# EAGLE board old_eagle_line_sensor (EAGLE 7.7.0), part 1 of 2
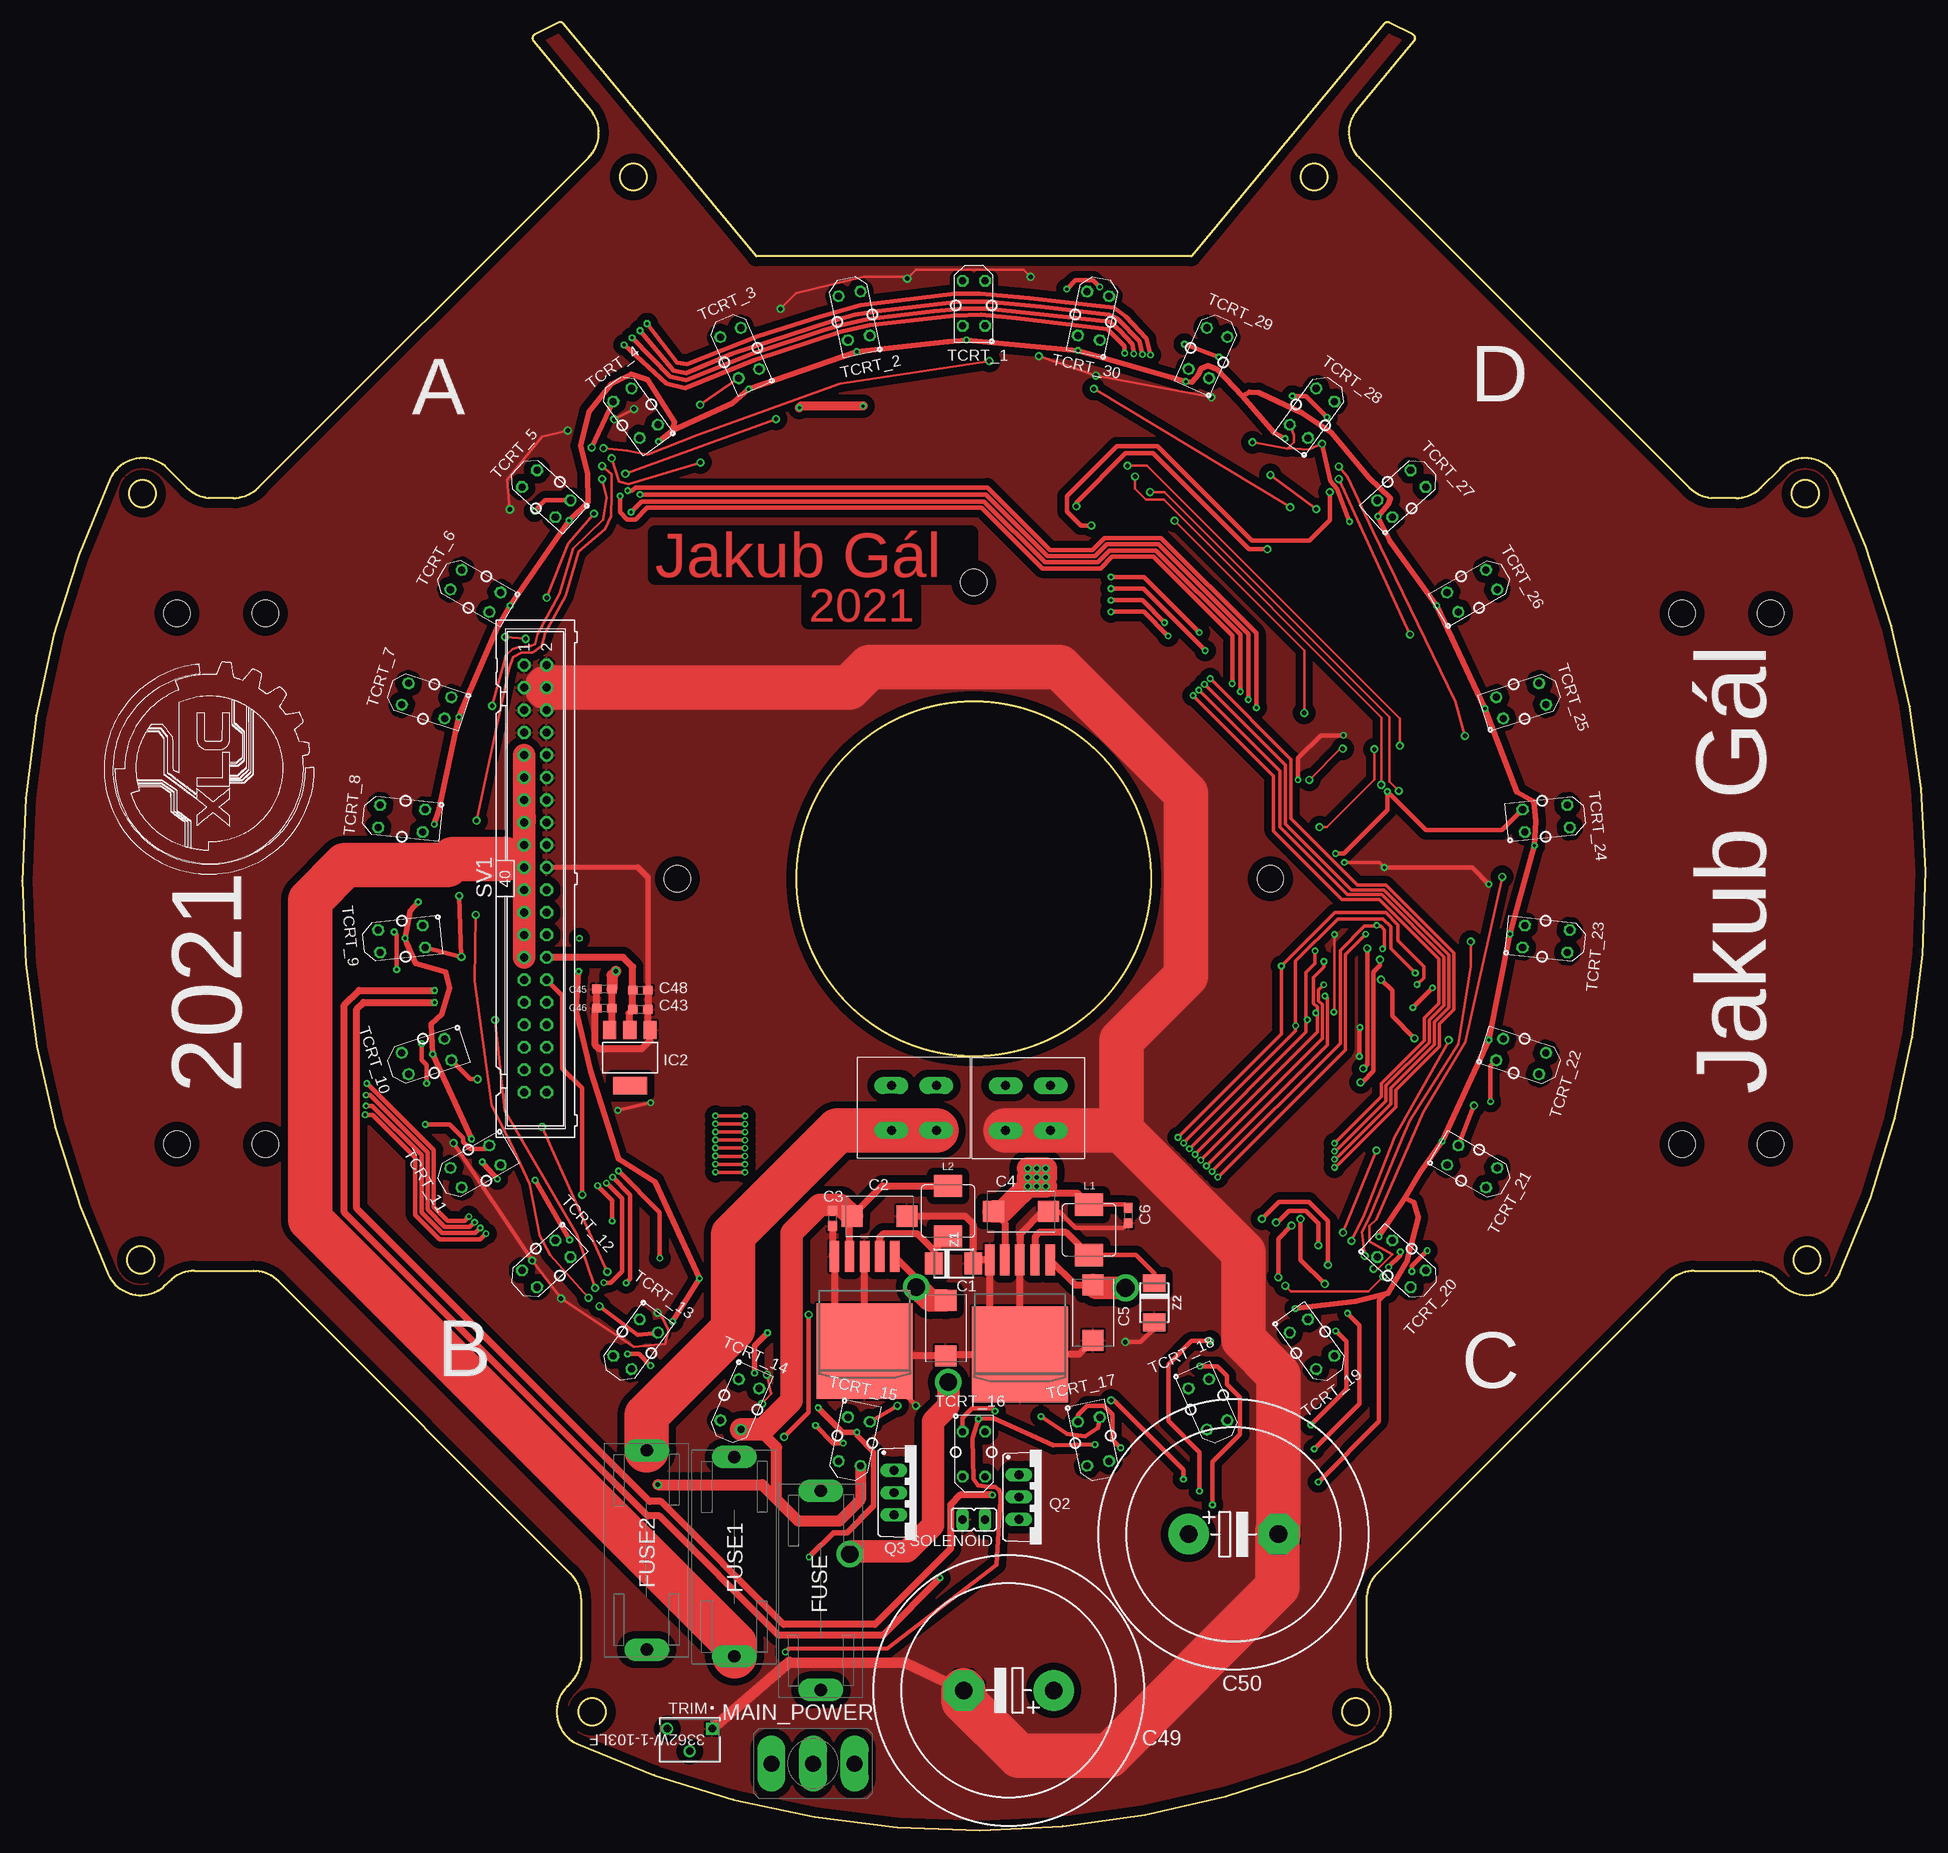
[diagram p2: board, top side]
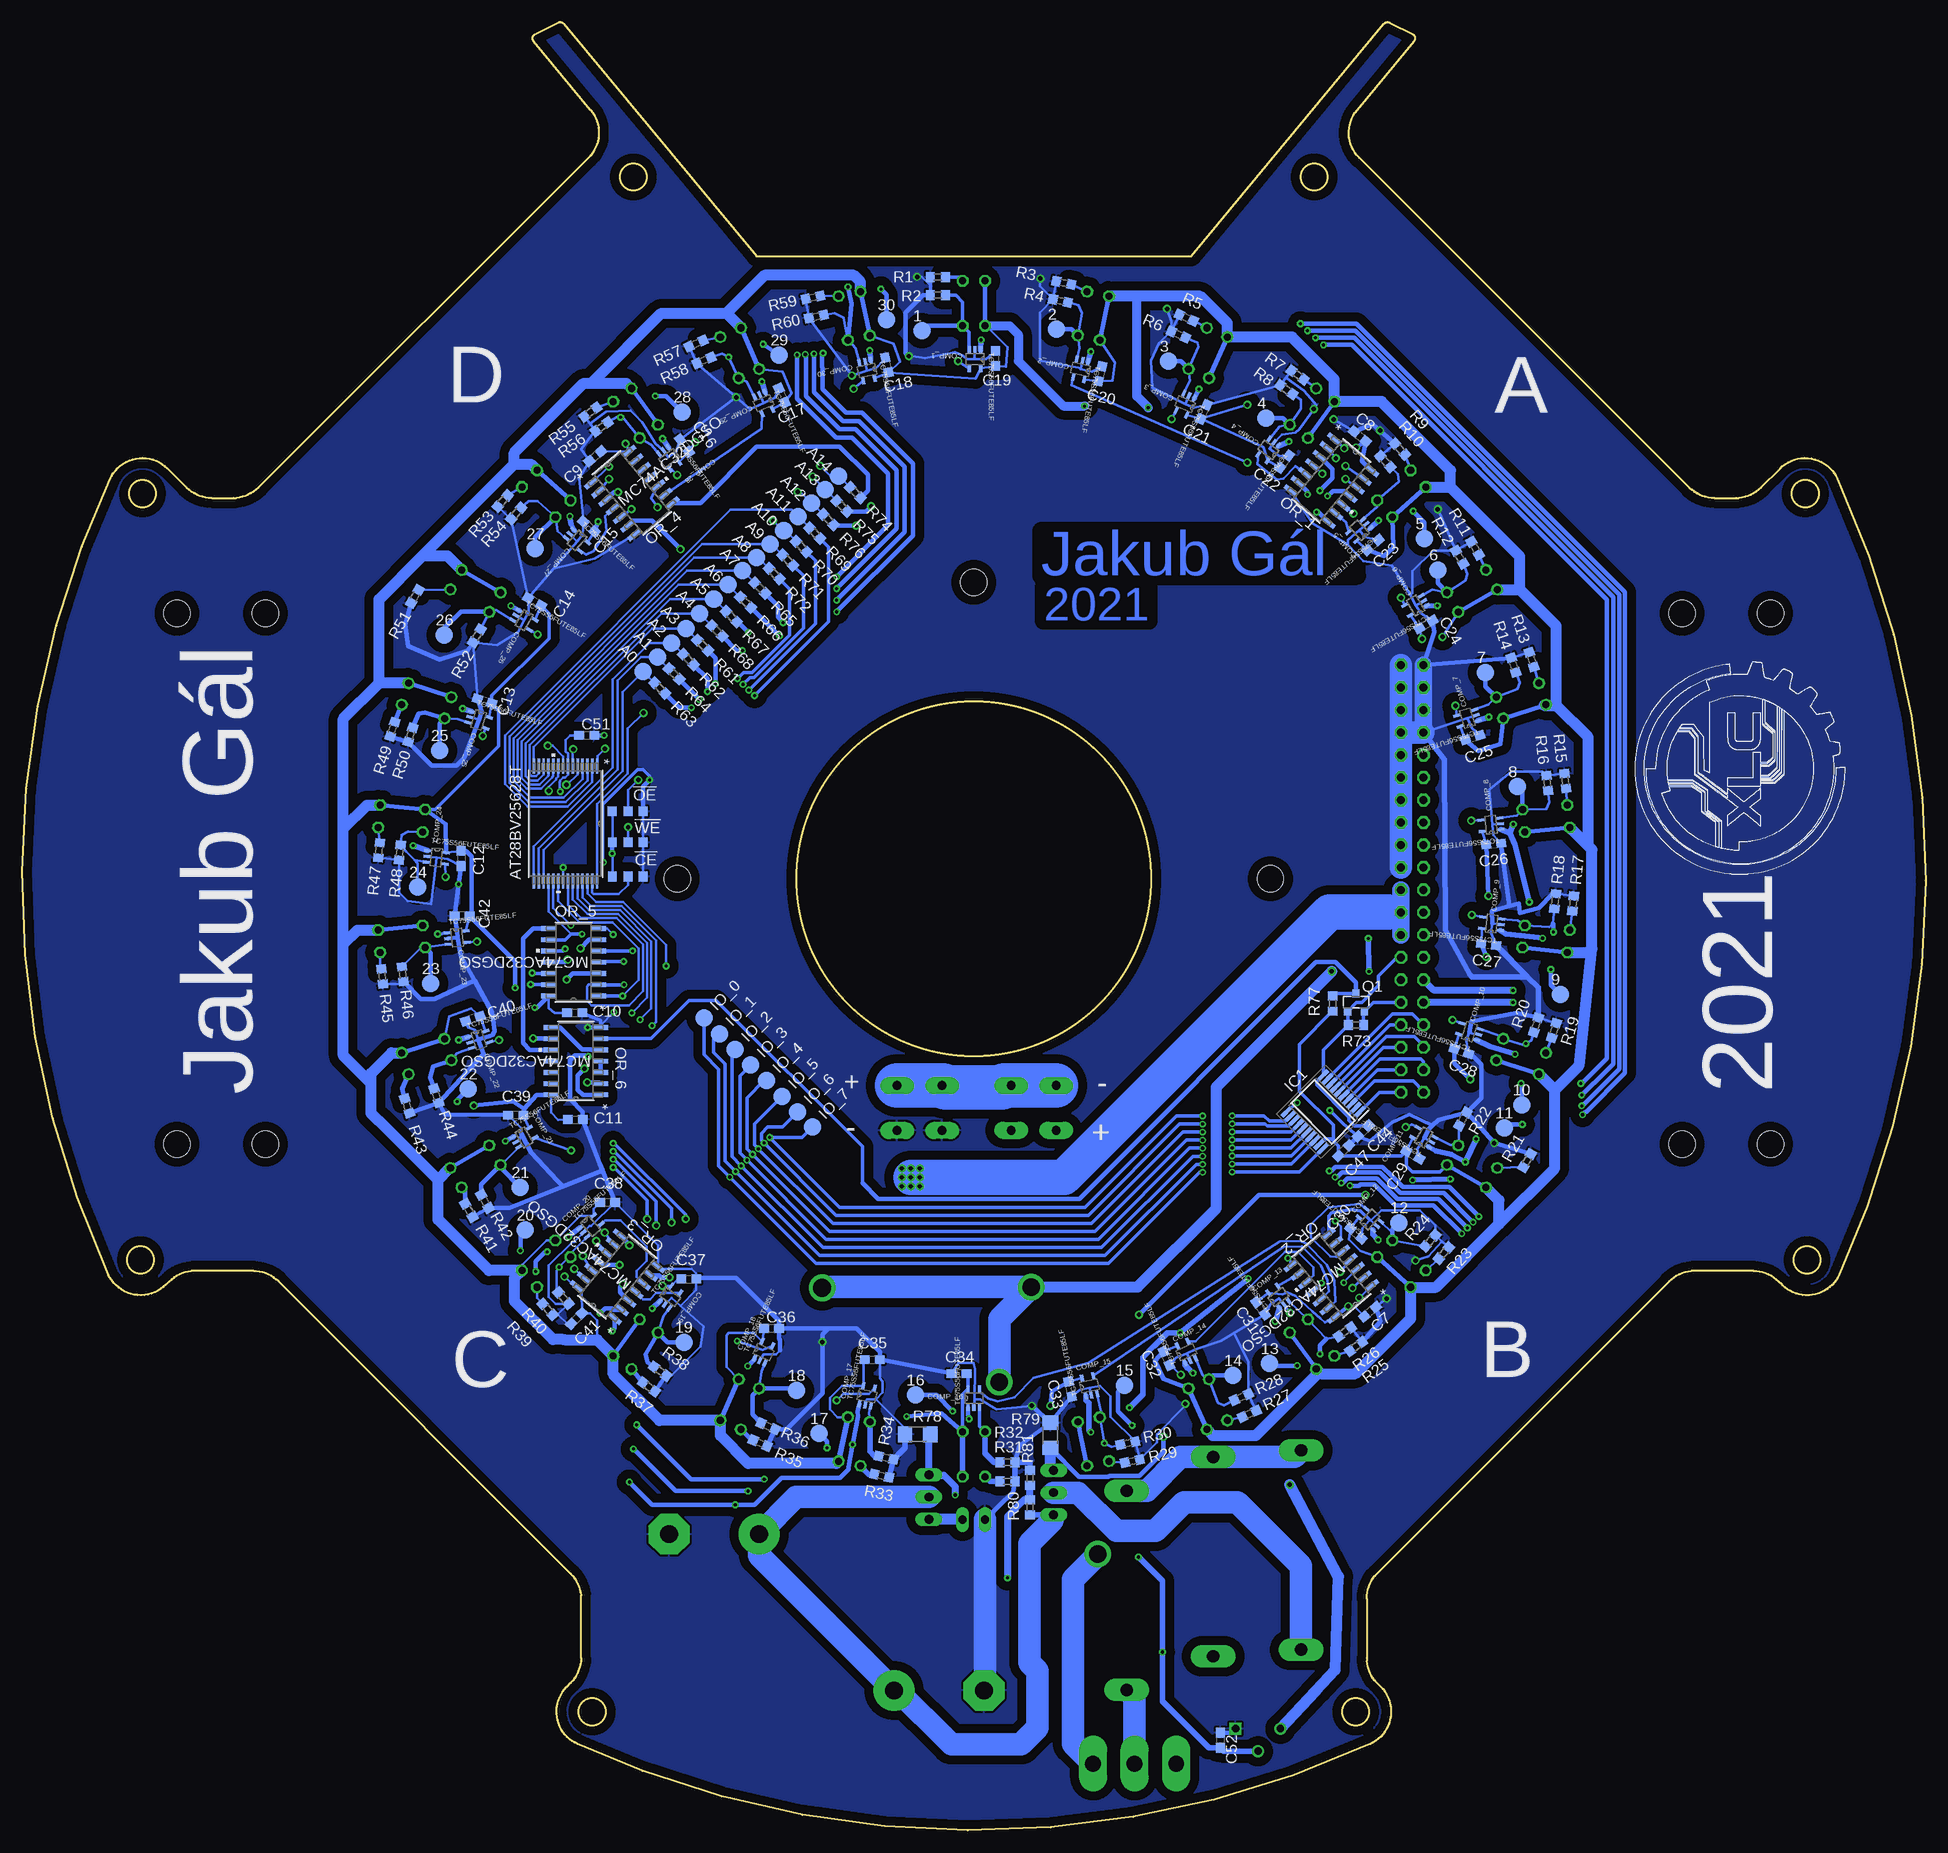
[diagram p3: board, bottom side, seen from below]

Size 215 x 204.25 mm. Coordinates in mm from the lower left corner, seen from the top.
Outline: 18.59,151.67 18.59,151.67 16.42,153.84 16.16,154.08 arc95 10.32,153.31 10.13,153.02 9.97,152.71 9.96,152.7 6.39,144.02 arc40 6.57,70.49 9.74,62.78 9.9,62.47 10.08,62.18 10.29,61.9 10.53,61.64 arc90 16.19,61.6 16.2,61.62 16.62,62.03 16.87,62.27 arc-40 19.44,63.2 26.13,63.2 26.48,63.19 arc-40 28.96,62.03 28.96,62.03 61.96,29 62.19,28.74 arc-40 63.13,26.17 63.13,19.49 63.11,19.14 arc-40 61.96,16.66 61.54,16.24 61.3,15.99 arc80 61.3,10.84 61.54,10.59 61.79,10.35 62.07,10.14 62.37,9.95 62.68,9.79 62.7,9.78 arc45 144.92,6.72 152.3,9.78 152.61,9.94 152.9,10.12 arc10 153.44,10.57 153.68,10.82 153.89,11.1 arc80 153.48,16.22 153.46,16.24 153.04,16.66 152.81,16.91 arc-40 151.87,19.49 151.87,26.17 151.89,26.52 arc-40 153.04,29 186.04,62.03 186.3,62.26 arc-40 188.87,63.2 195.55,63.2 195.9,63.19 arc-40 198.38,62.03 198.79,61.62 199.05,61.38 arc95 204.9,62.16 205.09,62.45 205.25,62.76 205.26,62.78 arc45 208.24,145.01 205.04,152.7 204.88,153.01 204.69,153.3 arc100 198.59,153.85 198.58,153.84 196.41,151.67 196.15,151.44 arc-40 193.58,150.5 191.16,150.5 190.81,150.51 arc-40 188.33,151.67 151.03,188.93 150.79,189.19 arc-80 150.77,194.31 157.23,202.12 157.26,202.16 arc55 157.31,202.62 157.3,202.66 157.28,202.69 157.25,202.73 157.23,202.76 157.2,202.8 157.16,202.83 arc0 157.09,202.88 157.08,202.88 154.45,204.2 arc0 154.32,204.25 154.28,204.25 154.24,204.25 154.19,204.25 154.15,204.25 154.11,204.24 arc35 153.85,204.08 153.84,204.07 132.05,177.8 82.94,177.8 61.15,204.07 61.13,204.11 arc70 60.56,204.21 60.55,204.2 57.92,202.88 57.89,202.86 arc0 57.82,202.81 57.79,202.78 arc80 57.76,202.14 57.77,202.12 64.23,194.31 64.44,194.03 arc-80 63.97,188.93 26.67,151.67 26.41,151.43 arc-40 23.84,150.5 21.42,150.5 21.07,150.51 arc-40 18.59,151.67
Outline: circle at 201.62,64.45 radius 1.5
Outline: circle at 201.41,151.01 radius 1.5
Outline: circle at 107.5,107.5 radius 20
Outline: circle at 69.05,186.77 radius 1.5
Outline: circle at 13.59,151.01 radius 1.5
Outline: circle at 13.38,64.45 radius 1.5
Outline: circle at 150.63,13.41 radius 1.5
Outline: circle at 64.37,13.41 radius 1.5
Outline: circle at 145.95,186.77 radius 1.5
Copper layers (1*16): Top 0.035mm / dielectric 1.5mm / Bottom 0.035mm
Design rules "default *": minimum track width 0.25mm, minimum drill 0.35mm, track to track 6mil, track to pad 6mil, pad to pad 6mil, via to via 6mil, smd to smd 6mil, copper to edge 40mil, drill to drill 6mil, minimum pad ring 10mil, minimum via ring 8mil, stop-mask expansion 4mil, vias tented up to drill 0mil, thermal gap 10mil
Holes 3 mm at 141,107.5 74,107.5 107.5,141 187.5,137.5 197.5,137.5 187.5,77.5 197.5,77.5 27.5,137.5 27.5,77.5 17.5,137.5 17.5,77.5

## Footprints (pad centres in the part's own frame; a part is rotated, then mirrored left to right if it is on the bottom)
TP20R = smd 2 x 2: TP 0,0
0603_S = smd 1 x 1.1: 1 -0.85,0; 2 0.85,0; 3 2.628,0
28T_ATM-M = smd 1.716 x 0.27: 1 -6.501,3.575; 2 -6.501,3.025; 3 -6.501,2.475; 4 -6.501,1.925; 5 -6.501,1.375; 6 -6.501,0.825; 7 -6.501,0.275; 8 -6.501,-0.275; 9 -6.501,-0.825; 10 -6.501,-1.375; 11 -6.501,-1.925; 12 -6.501,-2.475; 13 -6.501,-3.025; 14 -6.501,-3.575; 15 6.501,-3.575; 16 6.501,-3.025; 17 6.501,-2.475; 18 6.501,-1.925; 19 6.501,-1.375; 20 6.501,-0.825; 21 6.501,-0.275; 22 6.501,0.275; 23 6.501,0.825; 24 6.501,1.375; 25 6.501,1.925; 26 6.501,2.475; 27 6.501,3.025; 28 6.501,3.575
CAPM7343X310 = smd 2.368 x 2.404: 1 -3.121,0; 2 3.121,0
C0603 = smd 1.1 x 1: 1 -0.85,0; 2 0.85,0
EB30D = drill 2.007 pad 4.597: + -5.08,0 | drill 2.007 pad 4.597 octagon: - 5.08,0
SOT-353___(USV)_TOS = smd 0.833 x 0.355: 1 -1.039,0.65; 2 -1.039,0; 3 -1.039,-0.65; 4 1.039,-0.65; 5 1.039,0.65
SH22,5A = drill 1.397 pad 2.54 long: 1 -11.252,0; 2 11.252,0
SOP65P640X120-20N = smd 1.475 x 0.45: 1 -2.938,2.925; 2 -2.938,2.275; 3 -2.938,1.625; 4 -2.938,0.975; 5 -2.938,0.325; 6 -2.938,-0.325; 7 -2.938,-0.975; 8 -2.938,-1.625; 9 -2.938,-2.275; 10 -2.938,-2.925; 11 2.938,-2.925; 12 2.938,-2.275; 13 2.938,-1.625; 14 2.938,-0.975; 15 2.938,-0.325; 16 2.938,0.325; 17 2.938,0.975; 18 2.938,1.625; 19 2.938,2.275; 20 2.938,2.925
SOT223 = smd 1.499 x 2.007: 1 -2.261,-3.15; 2 0.025,-3.15; 3 2.311,-3.15 | smd 3.81 x 2.007: 4 0,3.15
TO263-5 = smd 1.067 x 3.505: 1 -3.404,0.762; 2 -1.702,0.762; 3 0,0.762; 4 1.702,0.762; 5 3.404,0.762 | smd 10.82 x 10.82: 6 0,11.43
INDUCTOR_L0630 = smd 2.5 x 3.2: 1 -2.85,0; 2 2.85,0
P-B069B = drill 1.803 pad 3.175 long: 1 -4.699,0; 2 0,0; 3 4.699,0
SOIC-14_NB_ONS-M = smd 1.702 x 0.533: 1 -2.807,3.81; 2 -2.807,2.54; 3 -2.807,1.27; 4 -2.807,0; 5 -2.807,-1.27; 6 -2.807,-2.54; 7 -2.807,-3.81; 8 2.807,-3.81; 9 2.807,-2.54; 10 2.807,-1.27; 11 2.807,0; 12 2.807,1.27; 13 2.807,2.54; 14 2.807,3.81
SOT23 = smd 0.8 x 0.9: 1 -0.95,-1; 2 0.95,-1; 3 0,1
TO220BV = drill 1.016 long: D 0,-2.54; G -2.54,-2.54; S 2.54,-2.54
R0603 = smd 1 x 1.1: 1 -0.85,0; 2 0.85,0
R1206 = smd 1.6 x 1.803: 1 -1.422,0; 2 1.422,0
JP1 = drill 0.914 long: 1 0,-1.27; 2 0,1.27
ML40 = drill 0.914 octagon: 1 -24.13,-1.27; 2 -24.13,1.27; 3 -21.59,-1.27; 4 -21.59,1.27; 5 -19.05,-1.27; 6 -19.05,1.27; 7 -16.51,-1.27; 8 -16.51,1.27; 9 -13.97,-1.27; 10 -13.97,1.27; 11 -11.43,-1.27; 12 -11.43,1.27; 13 -8.89,-1.27; 14 -8.89,1.27; 15 -6.35,-1.27; 16 -6.35,1.27; 17 -3.81,-1.27; 18 -3.81,1.27; 19 -1.27,-1.27; 20 -1.27,1.27; 21 1.27,-1.27; 22 1.27,1.27; 23 3.81,-1.27; 24 3.81,1.27; 25 6.35,-1.27; 26 6.35,1.27; 27 8.89,-1.27; 28 8.89,1.27; 29 11.43,-1.27; 30 11.43,1.27; 31 13.97,-1.27; 32 13.97,1.27; 33 16.51,-1.27; 34 16.51,1.27; 35 19.05,-1.27; 36 19.05,1.27; 37 21.59,-1.27; 38 21.59,1.27; 39 24.13,-1.27; 40 24.13,1.27
TCRT5000 = drill 0.8 octagon: A -2.54,-1.27; C 2.54,-1.27; E 2.54,1.27; K -2.54,1.27
POT_3362W = drill 0.838 pad 1.346 square: 1 0,0 | drill 0.838 pad 1.346: 2 2.54,2.54; 3 5.08,0
TERMINAL = drill 1 pad 1.93 long: 1 -2.413,2.794; 2 2.667,2.794; 3 -2.413,-2.286; 4 2.667,-2.286
SUPRESSOR_SMAJ = smd 2 x 2.5: A 2.223,0; C -2.223,0

## Placement (x,y rotation side)
1  PTR1TP20R  [TP20R]  113.35,169.39 0 bottom
2  PTR1TP20R  [TP20R]  98.15,169.58 0 bottom
3  PTR1TP20R  [TP20R]  85.5,165.95 0 bottom
4  PTR1TP20R  [TP20R]  74.48,159.54 0 bottom
5  PTR1TP20R  [TP20R]  56.59,145.89 0 bottom
6  PTR1TP20R  [TP20R]  55.09,142.38 0 bottom
7  PTR1TP20R  [TP20R]  49.7,130.8 0 bottom
8  PTR1TP20R  [TP20R]  46.11,117.89 0 bottom
9  PTR1TP20R  [TP20R]  41.27,94.43 0 bottom
10  PTR1TP20R  [TP20R]  45.62,81.96 0 bottom
11  PTR1TP20R  [TP20R]  47.59,79.35 0 bottom
12  PTR1TP20R  [TP20R]  59.47,68.64 0 bottom
13  PTR1TP20R  [TP20R]  74.09,52.73 0 bottom
14  PTR1TP20R  [TP20R]  78.22,51.39 0 bottom
15  PTR1TP20R  [TP20R]  90.47,50.28 0 bottom
16  PTR1TP20R  [TP20R]  114.1,49.17 0 bottom
17  PTR1TP20R  [TP20R]  124.99,44.83 0 bottom
18  PTR1TP20R  [TP20R]  127.52,49.7 0 bottom
19  PTR1TP20R  [TP20R]  140.25,55.14 0 bottom
20  PTR1TP20R  [TP20R]  158.16,67.81 0 bottom
21  PTR1TP20R  [TP20R]  158.74,72.63 0 bottom
22  PTR1TP20R  [TP20R]  164.61,83.76 0 bottom
23  PTR1TP20R  [TP20R]  168.86,95.66 0 bottom
24  PTR1TP20R  [TP20R]  170.3,106.55 0 bottom
25  PTR1TP20R  [TP20R]  167.85,121.98 0 bottom
26  PTR1TP20R  [TP20R]  167.32,135.04 0 bottom
27  PTR1TP20R  [TP20R]  157.04,144.77 0 bottom
28  PTR1TP20R  [TP20R]  140.44,160.22 0 bottom
29  PTR1TP20R  [TP20R]  129.48,166.66 0 bottom
30  PTR1TP20R  [TP20R]  117.38,170.63 0 bottom
!CE  0603_S  [0603_S]  145.71,107.75 180 bottom
!OE  0603_S  [0603_S]  145.72,115.11 180 bottom
!WE  0603_S  [0603_S]  145.7,111.61 180 bottom
A0  PTR1TP20R  [TP20R]  144.86,130.91 45 bottom
A1  PTR1TP20R  [TP20R]  143.24,132.52 45 bottom
A2  PTR1TP20R  [TP20R]  141.63,134.14 45 bottom
A3  PTR1TP20R  [TP20R]  140.01,135.76 45 bottom
A4  PTR1TP20R  [TP20R]  138.48,137.46 315 bottom
A5  PTR1TP20R  [TP20R]  136.87,139.08 315 bottom
A6  PTR1TP20R  [TP20R]  135.25,140.7 315 bottom
A7  PTR1TP20R  [TP20R]  133.63,142.31 315 bottom
A8  PTR1TP20R  [TP20R]  132.02,143.75 225 bottom
A9  PTR1TP20R  [TP20R]  130.49,145.28 225 bottom
A10  PTR1TP20R  [TP20R]  128.96,146.8 225 bottom
A11  PTR1TP20R  [TP20R]  127.35,148.42 225 bottom
A12  PTR1TP20R  [TP20R]  125.82,149.95 225 bottom
A13  PTR1TP20R  [TP20R]  124.29,151.47 225 bottom
A14  PTR1TP20R  [TP20R]  122.77,153 225 bottom
AT28BV25628T  AT28BV25628T_ATM-M  [28T_ATM-M]  153.62,113.73 270 bottom
C1  330uF  [CAPM7343X310]  104.33,56.73 270 top
C2  220uF  [CAPM7343X310]  96.85,69.38 0 top
C3  100nF  [C0603]  91.53,69.13 270 top
C4  220uF  [CAPM7343X310]  112.83,69.91 0 top
C5  330uF  [CAPM7343X310]  120.96,58.48 270 top
C6  100nF  [C0603]  124.94,69.45 270 top
C7  100nF  [C0603]  62.75,58.58 40 bottom
C8  100nF  [C0603]  63.88,157.46 140 bottom
C9  100nF  [C0603]  150.27,155.22 220 bottom
C10  100nF  [C0603]  152.58,92.36 0 bottom
C11  100nF  [C0603]  152.52,80.3 0 bottom
C12  100nF  [C0603]  165.41,109.79 270 bottom
C13  100nF  [C0603]  162.75,127.56 162 bottom
C14  100nF  [C0603]  157.12,138.78 150 bottom
C15  100nF  [C0603]  150.97,147.27 138 bottom
C16  100nF  [C0603]  140.18,156.41 126 bottom
C17  100nF  [C0603]  129.18,162.09 114 bottom
C18  100nF  [C0603]  117.31,165.52 102 bottom
C19  100nF  [C0603]  105.05,166.27 90 bottom
C20  100nF  [C0603]  93.2,164.53 78 bottom
C21  100nF  [C0603]  81.52,160.23 66 bottom
C22  100nF  [C0603]  72.4,154.6 54 bottom
C23  100nF  [C0603]  62.42,145.2 42 bottom
C24  100nF  [C0603]  56.42,136.23 30 bottom
C25  100nF  [C0603]  51.16,123.44 18 bottom
C26  100nF  [C0603]  48.79,111.41 6 bottom
C27  100nF  [C0603]  49.34,100.06 354 bottom
C28  100nF  [C0603]  52.42,88.01 342 bottom
C29  100nF  [C0603]  57.92,76.32 330 bottom
C30  100nF  [C0603]  64.35,67.44 318 bottom
C31  100nF  [C0603]  75.11,58.97 306 bottom
C32  100nF  [C0603]  85.73,53.32 294 bottom
C33  100nF  [C0603]  96.63,49.85 282 bottom
C34  100nF  [C0603]  109.17,51.6 180 bottom
C35  100nF  [C0603]  118.96,53.18 0 bottom
C36  100nF  [C0603]  130.34,56.71 0 bottom
C37  100nF  [C0603]  139.7,62.28 0 bottom
C38  100nF  [C0603]  148.87,70.94 0 bottom
C39  100nF  [C0603]  159.24,80.79 180 bottom
C40  100nF  [C0603]  164.08,91.69 198 bottom
C41  100nF  [C0603]  152.37,57.81 225 bottom
C42  100nF  [C0603]  165.3,103.29 180 bottom
C43  10uF  [C0603]  69.83,92.74 0 top
C44  100nF  [C0603]  63.51,79 225 bottom
C45  100nF  [C0603]  65.76,95.03 180 top
C46  10uF  [C0603]  65.76,92.87 180 top
C47  100nF  [C0603]  65.72,76.79 45 bottom
C48  100nF  [C0603]  69.83,94.9 0 top
C49  18000uF  [EB30D]  111.44,15.8 180 top
C50  18000uF  [EB30D]  136.84,33.46 0 top
C51  100nF  [C0603]  151.22,123.69 0 bottom
C52  100nF  [C0603]  79.66,10.18 270 bottom
COMP_1  TC75S56FUTE85LF  [SOT-353___(USV)_TOS]  107.37,166.17 270 bottom
COMP_2  TC75S56FUTE85LF  [SOT-353___(USV)_TOS]  95.43,165.03 258 bottom
COMP_3  TC75S56FUTE85LF  [SOT-353___(USV)_TOS]  83.62,161.09 246 bottom
COMP_4  TC75S56FUTE85LF  [SOT-353___(USV)_TOS]  74.22,155.93 234 bottom
COMP_5  TC75S56FUTE85LF  [SOT-353___(USV)_TOS]  63.94,146.87 222 bottom
COMP_6  TC75S56FUTE85LF  [SOT-353___(USV)_TOS]  57.59,138.36 210 bottom
COMP_7  TC75S56FUTE85LF  [SOT-353___(USV)_TOS]  51.76,125.64 198 bottom
COMP_8  TC75S56FUTE85LF  [SOT-353___(USV)_TOS]  49.08,113.59 186 bottom
COMP_9  TC75S56FUTE85LF  [SOT-353___(USV)_TOS]  49.01,102.41 174 bottom
COMP_10  TC75S56FUTE85LF  [SOT-353___(USV)_TOS]  51.51,90.22 162 bottom
COMP_11  TC75S56FUTE85LF  [SOT-353___(USV)_TOS]  56.7,78.29 150 bottom
COMP_12  TC75S56FUTE85LF  [SOT-353___(USV)_TOS]  62.77,69.01 138 bottom
COMP_13  TC75S56FUTE85LF  [SOT-353___(USV)_TOS]  73.08,60.25 126 bottom
COMP_14  TC75S56FUTE85LF  [SOT-353___(USV)_TOS]  83.5,54.03 114 bottom
COMP_15  TC75S56FUTE85LF  [SOT-353___(USV)_TOS]  94.43,50.21 102 bottom
COMP_16  TC75S56FUTE85LF  [SOT-353___(USV)_TOS]  107.5,48.82 90 bottom
COMP_17  TC75S56FUTE85LF  [SOT-353___(USV)_TOS]  119.56,49.08 78 bottom
COMP_18  TC75S56FUTE85LF  [SOT-353___(USV)_TOS]  131.25,54.03 66 bottom
COMP_19  TC75S56FUTE85LF  [SOT-353___(USV)_TOS]  141.79,60.25 54 bottom
COMP_20  TC75S56FUTE85LF  [SOT-353___(USV)_TOS]  150.81,68.26 42 bottom
COMP_21  TC75S56FUTE85LF  [SOT-353___(USV)_TOS]  158.3,78.29 30 bottom
COMP_22  TC75S56FUTE85LF  [SOT-353___(USV)_TOS]  163.41,89.32 18 bottom
COMP_23  TC75S56FUTE85LF  [SOT-353___(USV)_TOS]  165.86,100.85 6 bottom
COMP_24  TC75S56FUTE85LF  [SOT-353___(USV)_TOS]  168.21,109.91 354 bottom
COMP_25  TC75S56FUTE85LF  [SOT-353___(USV)_TOS]  163.43,125.43 342 bottom
COMP_26  TC75S56FUTE85LF  [SOT-353___(USV)_TOS]  158.3,136.71 330 bottom
COMP_27  TC75S56FUTE85LF  [SOT-353___(USV)_TOS]  152.33,145.73 318 bottom
COMP_28  TC75S56FUTE85LF  [SOT-353___(USV)_TOS]  141.92,155 306 bottom
COMP_29  TC75S56FUTE85LF  [SOT-353___(USV)_TOS]  131.25,161.22 294 bottom
COMP_30  TC75S56FUTE85LF  [SOT-353___(USV)_TOS]  119.56,164.9 282 bottom
FUSE  T20A  [SH22,5A]  90.23,27.11 90 top
FUSE1  T10A  [SH22,5A]  80.45,30.92 90 top
FUSE2  T20A  [SH22,5A]  70.54,31.68 90 top
IC1  TXB0108PWR  [SOP65P640X120-20N]  68.04,81.17 225 bottom
IC2  LD1117  [SOT223]  68.66,87.28 180 top
IO1  LM2596S-5  [TO263-5]  112.71,65.21 180 top
IO2  LM2596S-5  [TO263-5]  95.16,65.57 180 top
IO_0  PTR1TP20R  [TP20R]  137.99,91.75 45 bottom
IO_1  PTR1TP20R  [TP20R]  136.23,89.98 45 bottom
IO_2  PTR1TP20R  [TP20R]  134.46,88.22 45 bottom
IO_3  PTR1TP20R  [TP20R]  132.69,86.45 45 bottom
IO_4  PTR1TP20R  [TP20R]  130.93,84.68 45 bottom
IO_5  PTR1TP20R  [TP20R]  129.16,82.92 45 bottom
IO_6  PTR1TP20R  [TP20R]  127.4,81.15 45 bottom
IO_7  PTR1TP20R  [TP20R]  125.72,79.47 45 bottom
L1  22UH  [INDUCTOR_L0630]  120.5,67.83 90 top
L2  22UH  [INDUCTOR_L0630]  104.58,69.96 90 top
MAIN_POWER  [P-B069B]  89.34,7.55 0 top
OR_1  MC74AC32DGSO  [SOIC-14_NB_ONS-M]  67.11,152.46 320 bottom
OR_2  MC74AC32DGSO  [SOIC-14_NB_ONS-M]  67.11,62.67 220 bottom
OR_3  MC74AC32DGSO  [SOIC-14_NB_ONS-M]  147.76,62.54 140 bottom
OR_4  MC74AC32DGSO  [SOIC-14_NB_ONS-M]  146.13,151.07 40 bottom
OR_5  MC74AC32DGSO  [SOIC-14_NB_ONS-M]  152.7,98.07 180 bottom
OR_6  MC74AC32DGSO  [SOIC-14_NB_ONS-M]  152.45,86.9 180 bottom
Q1  BSS138  [SOT23]  64.32,93.53 0 bottom
Q2  [TO220BV]  115.12,37.65 270 top
Q3  [TO220BV]  101.02,38.16 270 top
R1  1K  [R0603]  111.56,175.44 180 bottom
R2  10K  [R0603]  111.56,173.41 180 bottom
R3  1K  [R0603]  97.34,174.81 168 bottom
R4  10K  [R0603]  97.72,172.78 168 bottom
R5  1K  [R0603]  83.5,170.87 156 bottom
R6  10K  [R0603]  84.39,168.97 156 bottom
R7  1K  [R0603]  70.92,164.39 144 bottom
R8  10K  [R0603]  72.19,162.74 144 bottom
R9  1K  [R0603]  59.37,156.01 132 bottom
R10  10K  [R0603]  61.02,154.62 132 bottom
R11  1K  [R0603]  50.86,144.84 120 bottom
R12  10K  [R0603]  52.64,143.82 120 bottom
R13  1K  [R0603]  44.51,132.26 108 bottom
R14  10K  [R0603]  46.54,131.63 108 bottom
R15  1K  [R0603]  40.7,118.55 96 bottom
R16  10K  [R0603]  42.73,118.29 96 bottom
R17  1K  [R0603]  39.81,104.7 84 bottom
R18  10K  [R0603]  41.84,104.96 84 bottom
R19  1K  [R0603]  41.97,90.35 72 bottom
R20  10K  [R0603]  44,90.99 72 bottom
R21  1K  [R0603]  45.01,75.66 60 bottom
R22  10K  [R0603]  52.26,80.36 60 bottom
R23  1K  [R0603]  54.41,65.21 48 bottom
R24  10K  [R0603]  55.94,66.6 48 bottom
R25  1K  [R0603]  64.32,54.67 36 bottom
R26  10K  [R0603]  65.59,56.32 36 bottom
R27  1K  [R0603]  76.38,47.05 24 bottom
R28  10K  [R0603]  77.27,48.95 24 bottom
R29  1K  [R0603]  89.59,41.71 12 bottom
R30  10K  [R0603]  90.1,43.74 12 bottom
R31  1K  [R0603]  103.69,39.43 0 bottom
R32  10K  [R0603]  103.69,41.59 0 bottom
R33  1K  [R0603]  117.91,40.06 348 bottom
R34  10K  [R0603]  117.41,42.09 348 bottom
R35  1K  [R0603]  131.63,43.74 336 bottom
R36  10K  [R0603]  130.74,45.65 336 bottom
R37  1K  [R0603]  144.2,50.09 324 bottom
R38  10K  [R0603]  142.93,51.87 324 bottom
R39  1K  [R0603]  155.63,58.86 312 bottom
R40  10K  [R0603]  153.85,60.13 312 bottom
R41  1K  [R0603]  164.52,70.03 300 bottom
R42  10K  [R0603]  162.74,71.05 300 bottom
R43  1K  [R0603]  171.51,81.84 288 bottom
R44  10K  [R0603]  168.21,82.99 288 bottom
R45  1K  [R0603]  174.32,96.45 276 bottom
R46  10K  [R0603]  172,96.72 276 bottom
R47  1K  [R0603]  174.68,110.71 264 bottom
R48  10K  [R0603]  172.33,110.46 264 bottom
R49  1K  [R0603]  173.16,124.39 252 bottom
R50  10K  [R0603]  171.13,123.75 252 bottom
R51  1K  [R0603]  170.62,139.38 240 bottom
R52  10K  [R0603]  163.63,134.93 240 bottom
R53  1K  [R0603]  160.71,150.17 228 bottom
R54  10K  [R0603]  159.19,148.77 228 bottom
R55  1K  [R0603]  150.81,160.2 216 bottom
R56  10K  [R0603]  149.54,158.55 216 bottom
R57  1K  [R0603]  138.87,167.95 204 bottom
R58  10K  [R0603]  137.98,166.05 204 bottom
R59  1K  [R0603]  125.66,173.16 192 bottom
R60  10K  [R0603]  125.28,171 192 bottom
R61  0R  [R0603]  138.12,133.87 315 bottom
R62  0R  [R0603]  139.74,132.25 315 bottom
R63  0R  [R0603]  142.97,129.02 315 bottom
R64  0R  [R0603]  141.36,130.64 315 bottom
R65  0R  [R0603]  131.66,140.34 315 bottom
R66  0R  [R0603]  133.28,138.72 315 bottom
R67  0R  [R0603]  134.89,137.1 315 bottom
R68  0R  [R0603]  136.51,135.49 315 bottom
R69  0R  [R0603]  125.46,146.53 315 bottom
R70  0R  [R0603]  126.99,145.01 315 bottom
R71  0R  [R0603]  128.52,143.48 315 bottom
R72  0R  [R0603]  130.04,141.95 315 bottom
R73  10K  [R0603]  64.32,90.99 0 bottom
R74  0R  [R0603]  120.88,151.11 315 bottom
R75  0R  [R0603]  122.41,149.59 315 bottom
R76  0R  [R0603]  123.94,148.06 315 bottom
R77  10K  [R0603]  66.97,93.38 90 bottom
R78  10K  [R1206]  113.85,44.76 0 bottom
R79  10K  [R1206]  98.86,44.63 270 bottom
R80  10K  [R0603]  101.15,36.51 90 bottom
R81  2K  [R0603]  101.15,39.81 90 bottom
SOLENOID  [JP1]  107.5,35.11 90 top
SV1  [ML40]  57.97,107.5 270 top
TCRT_1  [TCRT5000]  107.5,172.5 270 top
TCRT_2  [TCRT5000]  93.99,171.08 282 top
TCRT_3  [TCRT5000]  81.06,166.88 294 top
TCRT_4  [TCRT5000]  69.29,160.08 306 top
TCRT_5  [TCRT5000]  59.2,150.99 318 top
TCRT_6  [TCRT5000]  51.21,140 330 top
TCRT_7  [TCRT5000]  45.68,127.58 342 top
TCRT_8  [TCRT5000]  42.86,114.29 354 top
TCRT_9  [TCRT5000]  42.86,100.7 6 top
TCRT_10  [TCRT5000]  45.68,87.41 18 top
TCRT_11  [TCRT5000]  51.21,75 30 top
TCRT_12  [TCRT5000]  59.2,64.01 42 top
TCRT_13  [TCRT5000]  69.29,54.91 54 top
TCRT_14  [TCRT5000]  81.06,48.12 66 top
TCRT_15  [TCRT5000]  93.99,43.92 78 top
TCRT_16  [TCRT5000]  107.5,42.5 90 top
TCRT_17  [TCRT5000]  121.01,43.92 102 top
TCRT_18  [TCRT5000]  133.94,48.12 114 top
TCRT_19  [TCRT5000]  145.71,54.91 126 top
TCRT_20  [TCRT5000]  155.8,64.01 138 top
TCRT_21  [TCRT5000]  163.79,75 150 top
TCRT_22  [TCRT5000]  169.32,87.41 162 top
TCRT_23  [TCRT5000]  172.14,100.7 174 top
TCRT_24  [TCRT5000]  172.14,114.29 186 top
TCRT_25  [TCRT5000]  169.32,127.58 198 top
TCRT_26  [TCRT5000]  163.79,140 210 top
TCRT_27  [TCRT5000]  155.8,150.99 222 top
TCRT_28  [TCRT5000]  145.71,160.08 234 top
TCRT_29  [TCRT5000]  133.94,166.88 246 top
TCRT_30  [TCRT5000]  121.01,171.08 258 top
TRIM  3362W-1-103LF  [POT_3362W]  77.94,11.49 180 top
U$4  TERMINAL  [TERMINAL]  100.86,81.86 180 top
U$5  TERMINAL  [TERMINAL]  113.5,81.34 0 top
Z1  1n5824  [SUPRESSOR_SMAJ]  105.21,64.05 0 top
Z2  1n5824  [SUPRESSOR_SMAJ]  127.88,59.6 270 top

## Tracks (layer width: path | path; a pad name or v marks a point on that pad's centre or on a via)
3.3V
  Top 0.813: IC2.2 68.53,90.53 68.53,92.3 C43.1 C48.1 68.98,97.53 67.89,98.62 SV1.28
  Bottom 0.406: IC1.2 65.12,80.86 65.12,80.56 | C44.1 64.53,79.6 65.12,80.19 65.12,80.56 | 65.12,80.56 68.77,84.21 68.77,84.57 IC1.10 68.03,88.13 R73.1 65.27,91.09 Q1.1 64.26,93.54 63.69,93.54 61.8,95.42 61.8,96.53 59.72,98.61 SV1.28
5V  (via drill 0.35, 0.35 pad 0.6, 0.5)
  Top 0.305: v142.68,61.52 143.31,60.89 152.06,60.89 v153.74,62.57 | v54.56,134.8 v56.87,134.6 | v76.6,161.03 TCRT_3.C | v138.97,156.79 142.9,156.1 142.97,156.16 | 142.97,156.16 143.67,156.8 143.67,157.58 TCRT_28.C | v146.83,156.62 145.29,155.96 142.97,156.16
  Top 0.508: v98.86,47.97 TCRT_15.C | v65.21,59.21 69.52,55.97 TCRT_13.C | v163.99,81.86 TCRT_21.C | TCRT_9.C v49.61,98.67 v49.36,105.55 | v51.44,84.85 50.63,84.85 TCRT_10.C | v64.34,156.22 TCRT_4.A | v148.37,110.33 149.28,110.33 154.22,115.27 v154.22,117.34 158.59,112.97 167.17,112.97 TCRT_24.C | v157.09,92.94 159.32,95.16 v159.32,95.18 | v149.94,147.84 148.54,151.55 147.79,152.39 v146.83,156.62 | v115.09,46.75 118.03,44.79 120.08,44.5 121.53,45.48 TCRT_17.C
  Top 0.813: IO2.4 93.46,69.11 C2.1 | C3.1 93.14,69.98 C2.1 | C2.1 97.15,72.81 L2.2
  Top 1.016: v95,160.9 88,160.9 v87.8,160.7
  Top 1.27: TCRT_15.A 94.7,37.36 92.28,34.94 87.69,34.94 85.23,37.4 | TCRT_14.A 83.19,45.28 85.23,43.24 85.23,37.4 | v71.81,39.04 83.59,39.04 85.23,37.4
  Top 2.54: C2.1 92.45,70.67 90.09,70.67 86.9,67.48 86.9,48.52 83.67,45.28 TCRT_14.A
  Bottom 0.3: v154.22,117.34 154.22,117.73 154.28,117.8 154.28,118.42 154.22,118.48 154.22,118.6 153.88,118.94 153.67,118.94 153.35,119.26 AT28BV25628T.7 153.35,121.61 153.6,121.86 153.6,123.17 153.07,123.69 C51.1
  Bottom 0.305: TCRT_17.C 122.87,46.67 123.76,47.55 123.76,48.88 122.41,50.23 COMP_17.5 119.98,53.01 C35.1 | C37.1 140.78,62.4 COMP_19.5 142.63,61.48 v142.68,61.52 | C36.1 131.38,55.28 COMP_18.5 132.37,56.19 135.19,56.19 135.44,55.94 135.44,52.33 TCRT_18.C | TCRT_20.A 158.54,63.88 155.77,66.65 TCRT_20.C 151.98,69.43 COMP_20.5 150.47,70.2 C38.1 | 150.04,55.42 150.04,55.43 150.04,57.59 150.84,58.39 C41.1 151.83,60.9 OR_3.14 152.59,61.43 v153.74,62.57 | 153.72,55.43 153.85,55.43 153.87,55.45 | COMP_21.5 158.34,80.68 | 158.34,80.68 C39.1 | COMP_22.5 C40.1 164.31,92.86 166.77,91.96 TCRT_22.C | C10.1 154.86,92.36 155.51,92.91 OR_5.14 | C11.1 154.45,80.27 155.22,81.09 OR_6.14 | 158.34,80.68 158.31,81.52 | COMP_23.5 C42.1 | COMP_25.5 162.19,126.02 C13.1 | COMP_26.5 C14.1 | C15.1 COMP_27.5 | COMP_28.5 C16.1 v138.97,156.79 | COMP_29.5 C17.1 128.07,162.36 129.09,164.78 TCRT_29.C | C18.1 COMP_30.5 | 106.67,165.14 C19.1 103.85,165.34 103.69,167.56 106.23,170.07 | 106.67,165.14 COMP_1.5 | COMP_2.5 C20.1 91.85,163.76 91.57,165.77 TCRT_2.C | C21.1 COMP_3.5 | C22.1 COMP_4.5 74.31,154.73 74.76,156.26 C21.1 | C23.1 63.13,144.7 COMP_5.5 | COMP_6.5 C24.1 v56.87,134.6 | C25.1 COMP_7.5 | C26.1 COMP_8.5 | C27.1 COMP_9.5 | C28.1 COMP_10.5 | C29.1 COMP_11.5 | COMP_12.5 C30.1 65.13,66.77 63.86,65.48 TCRT_12.C | C31.1 COMP_13.5 72.65,60.55 72.1,60.78 71.18,60.4 69.26,58.65 68.34,57.81 67.83,57.36 OR_2.14 | C7.1 64.5,59.21 v65.21,59.21 | COMP_14.5 C32.1 | COMP_15.5 C33.1 | C12.1 COMP_24.5 | TCRT_6.C v54.56,134.8 | C18.1 115.82,165.9 116.58,167.93 TCRT_30.C | C18.1 107.3,164.01 106.67,165.14 | C21.1 v76.6,161.03 | C9.1 OR_4.14 v146.83,156.62 | !CE.3 148.33,107.76 !WE.3 148.33,115.1 !OE.3
  Bottom 0.406: C34.1 108.15,51.43 COMP_16.5 108.77,49.24 TCRT_16.C | C14.1 155.48,137.45 155.48,134.63 161.94,128.17 C13.1 161.16,126.52 161.16,122.48 168.35,115.29 TCRT_24.C | IC1.19 67.88,78.12 67.11,78.12 66.87,77.88 | 66.87,77.88 66.32,77.32 C47.1 59.21,76.19 C29.1 58.65,75.06 57.97,74.38 54.83,74.38 TCRT_11.C | 66.87,77.88 66.87,79.66 70.7,83.49 70.7,88.8 R77.1
  Bottom 0.508: TCRT_18.C TCRT_18.A | TCRT_19.A TCRT_19.C | TCRT_21.A TCRT_21.C | TCRT_22.C TCRT_22.A | TCRT_23.C TCRT_23.A | TCRT_24.A 172.45,115.6 TCRT_24.C 167.18,113.67 COMP_24.5 | TCRT_25.C TCRT_25.A | TCRT_26.C TCRT_26.A | TCRT_27.C TCRT_27.A | TCRT_28.C TCRT_28.A | TCRT_29.C TCRT_29.A | TCRT_30.C TCRT_30.A | TCRT_1.C 106.23,170.07 TCRT_1.A | TCRT_2.C TCRT_2.A | TCRT_3.C TCRT_3.A | TCRT_4.C TCRT_4.A | TCRT_5.A TCRT_5.C 60.1,144.88 61.16,143.95 63.13,144.7 | TCRT_6.C TCRT_6.A | TCRT_7.A 43.11,127.08 TCRT_7.C 48.02,122.7 50.53,121.92 C25.1 | TCRT_8.A TCRT_8.C | TCRT_9.A TCRT_9.C | TCRT_10.A TCRT_10.C | TCRT_11.A TCRT_11.C | TCRT_12.A TCRT_12.C | TCRT_13.A TCRT_13.C | TCRT_14.A TCRT_14.C 86.09,51.02 87.07,53.04 C32.1 | TCRT_15.A 95.39,44.42 TCRT_15.C | C33.1 98.67,49.58 v98.86,47.97 | OR_2.14 v65.21,59.21 | C39.1 158.31,81.52 | 158.31,81.52 156.89,83.07 OR_6.14 | 158.31,81.52 159.52,82.36 v163.99,81.86 | C27.1 v49.61,98.67 | C28.1 53.23,86.64 v51.44,84.85 | C26.1 v49.36,105.55 | OR_1.14 63.69,154.65 C8.1 v64.34,156.22 | !WE.3 148.37,111.57 v148.37,110.33 | OR_5.14 156.83,92.94 v157.09,92.94 | v159.32,95.18 159.32,98.15 C42.1 164.23,103.52 164.23,110.03 164.85,110.64 C12.1 | C15.1 v149.94,147.84 | TCRT_16.C 111.14,47.1 v115.09,46.75
  Bottom 0.61: TCRT_16.A TCRT_16.C | TCRT_17.A TCRT_17.C
  Bottom 1.016: TCRT_1.C 103.45,169.96 102.47,168.98 102.47,165.97 97.4,160.9 v95,160.9 | v87.8,160.7 89.1,162 89.1,173.3
  Bottom 1.27: 153.72,55.43 150.04,55.43 | 150.04,55.42 TCRT_19.A 148.23,51.53 143.01,46.31 TCRT_18.A 136.13,44.6 132.98,41.45 123.03,41.45 TCRT_17.A | 153.87,55.45 155.05,55.45 159.4,59.8 159.4,62.39 TCRT_20.A 162.27,63.25 168.03,69.01 168.03,73.5 | 168.03,73.5 166.7,74.83 TCRT_21.A | 168.03,73.5 174.69,80.16 174.75,80.16 175.6,81 175.6,84.39 | 175.6,84.39 175.6,85.52 173.28,87.84 TCRT_22.A | 175.6,84.39 178.71,87.51 178.71,100.12 | TCRT_23.A 177.13,101.7 178.71,100.12 | 178.71,100.12 178.71,113.16 | TCRT_24.A 176.05,115.82 178.71,113.16 | 178.71,113.16 178.71,125.57 174.7,129.58 | TCRT_25.A 174.7,129.58 | 174.7,129.58 174.7,139.04 169.75,144 | 169.75,144 166.98,144 TCRT_26.A | 169.75,144 159.42,154.32 | TCRT_27.A 157.53,154.32 159.42,154.32 | 159.42,154.32 159.42,155.61 151.56,163.47 150.7,163.47 | 150.7,163.47 146.76,163.47 TCRT_28.A | 150.7,163.47 142.81,171.36 135.45,171.36 | TCRT_29.A 135.45,171.36 | 135.45,171.36 131.14,175.67 121.04,175.67 120.3,174.93 TCRT_30.A | TCRT_14.A 80.53,44.62 75.64,44.62 68.83,51.43 TCRT_13.A 68.29,51.58 64.41,51.58 58.16,57.82 TCRT_12.A 55.31,61.36 48.18,68.48 | 48.18,68.48 48.18,71.17 TCRT_11.A | 48.18,68.48 41.89,74.77 41.89,83.66 | TCRT_10.A 41.89,83.66 | 41.89,83.66 39.13,86.42 37.69,99.58 | TCRT_9.A 37.88,99.18 37.99,99.28 37.69,99.58 | 38.1,111.2 37.69,110.79 37.69,99.58 | 38.1,111.2 TCRT_8.A | 38.1,111.2 38.1,123.48 41.71,127.08 | 43.11,127.08 41.71,127.08 | 41.71,127.08 41.71,136.05 45.82,140.17 | TCRT_6.A 45.82,140.17 | 45.82,140.17 45.82,143.91 53.67,151.75 | TCRT_5.A 53.67,151.75 | 53.67,151.75 53.67,153.62 61.44,161.39 TCRT_4.A 66.77,163.89 71.57,168.68 TCRT_3.A 78.87,170.26 81.91,173.3 89.1,173.3 TCRT_2.A
  Bottom 1.27: TRIM.3 68.85,15.77 66.66,18.12 66.3,28.64 v71.81,39.04
5V_JATSON  (via drill 0.5)
  Top 0.508: L1.2 124.57,70.68 C6.1
  Top 0.813: IO1.4 111,68.61 C4.1 110.4,69.91 112.49,71.99 119.19,71.99 L1.2
  Top 2.54: v113.6,74.77 v114.61,74.77 v115.63,74.77 v115.63,73.76 v114.61,73.76 | v114.61,73.76 v113.6,73.76 v113.6,72.74 v114.61,72.74 v115.63,72.74 | C4.1 110.76,69.91 v114.61,73.76
  Bottom 1.27: 60.67,103.73 59.28,103.73 SV1.24
  Bottom 2: SV1.22 SV1.24 SV1.26
  Bottom 4: 60.67,103.73 67.32,103.73 97.29,73.76 v114.61,73.76
!CE
  Bottom 0.305: !CE.2 146.56,106.79 147.6,105.75 150.42,105.75 150.6,105.92 AT28BV25628T.27
!OE  (via drill 0.5)
  Top 0.305: v149.17,122.18 148.92,122.18 v145.4,118.66
  Bottom 0.305: !OE.2 146.57,117.49 v145.4,118.66 | v149.17,122.18 149.99,121.37 149.99,120.29 AT28BV25628T.1
!WE  (via drill 0.5)
  Top 0.305: v152.75,122.12 152.75,118.68 147.39,113.32 v146.55,113.32
  Bottom 0.305: !WE.2 v146.55,113.32 | v152.75,122.12 152.8,122.07 AT28BV25628T.6
A0
  Bottom 0.305: AT28BV25628T.17 156.1,110.77 147.18,119.69 147.18,128.59 A0.TP R63.1
A1
  Bottom 0.305: AT28BV25628T.16 156.65,110.92 147.73,119.84 147.73,129.88 145.09,132.52 A1.TP R64.1
A2
  Bottom 0.305: AT28BV25628T.15 157.2,111.11 148.28,120.03 148.28,129.98 144.12,134.14 A2.TP R62.1
A3
  Bottom 0.305: R61.1 A3.TP 143.84,135.76 157.2,122.4 AT28BV25628T.14
A4
  Bottom 0.305: AT28BV25628T.13 156.65,119.36 156.94,119.07 157.46,119.07 157.65,119.26 157.65,122.59 142.78,137.46 A4.TP R68.1
A5
  Bottom 0.305: AT28BV25628T.12 156.1,119.26 156.75,118.61 157.65,118.61 158.11,119.08 158.11,122.78 141.81,139.08 A5.TP R67.1
A6
  Bottom 0.305: R66.1 A6.TP 140.84,140.7 158.57,122.97 158.57,118.89 157.84,118.15 156.56,118.15 155.59,119.12 155.59,119.17 155.55,119.21 AT28BV25628T.11
A7
  Bottom 0.3: 139.87,142.31 A7.TP R65.1
  Bottom 0.305: 139.87,142.31 159.03,123.16 159.03,118.7 158.03,117.7 156.37,117.7 155.13,118.93 155.13,118.98 155,119.11 AT28BV25628T.10
A8
  Bottom 0.305: R72.1 131.84,143.75 A8.TP 139.08,143.75 159.48,123.35 159.48,118.51 157.62,116.65 153.81,116.65 151.7,118.76 AT28BV25628T.4
A9
  Bottom 0.305: R71.1 130.31,145.28 A9.TP 138.2,145.28 159.94,123.53 159.94,118.32 157.76,116.14 153.59,116.14 151.15,118.58 AT28BV25628T.3
A10  (via drill 0.5)
  Top 0.305: v144.82,126.22 144.82,133.28 v130.18,147.92
  Bottom 0.305: v144.82,126.22 146.6,124.44 146.6,119.4 150.05,115.95 AT28BV25628T.28 | v130.18,147.92 129.06,146.8 A10.TP 128.78,146.8 R70.1
A11
  Bottom 0.305: R69.1 A11.TP 128.1,149.17 134.95,149.17 160.44,123.68 160.44,118.17 157.91,115.64 153.37,115.64 150.6,118.42 AT28BV25628T.2
A12  (via drill 0.5)
  Top 0.305: v155.51,117.41 154.46,118.46 154.46,125.76 129.05,151.17 v127.4,151.17
  Bottom 0.305: R76.1 A12.TP 127.05,151.17 v127.4,151.17 | v155.51,117.41 155.51,117.86 154.67,118.7 154.67,118.79 154.45,119.01 AT28BV25628T.9
A13  (via drill 0.5)
  Top 0.305: v153.52,118.11 153.52,125.72 128.95,150.3 126.96,150.3 125.71,151.55 v125.71,152.92
  Bottom 0.305: R75.1 A13.TP 124.29,151.51 v125.71,152.92 | AT28BV25628T.5 152.25,119.29 153.43,118.11 v153.52,118.11
A14  (via drill 0.5)
  Top 0.305: v155.63,122.52 155.63,125.59 127.07,154.14 v124.85,154.14
  Bottom 0.305: R74.1 A14.TP 123.7,153 v124.85,154.14 | v155.63,122.52 155.1,122.52 153.9,121.32 AT28BV25628T.8
BAT  (via drill 0.5, 2)
  Top 0.813: C1.1 103.52,59.85 IO2.1 | C5.1 118.96,61.6 IO1.1 | IC2.3 66.37,90.43 66.61,90.67 C46.1 C45.1
  Top 1.27: v67.07,97.05 66.61,96.59 C45.1
  Top 2.54: v93.49,31.2 93.82,31.53 99.95,31.53 102.88,34.47 102.88,46.21 104.62,47.95 v104.62,50.62 | C1.1 102.52,59.85 v101.01,61.37 | C5.1 121.28,61.28 v124.64,61.28
  Bottom 1.27: v101.01,61.37 89,61.37 80.11,70.26 80.11,83.96 67.07,97 v67.07,97.05
  Bottom 2.54: MAIN_POWER.3 96.3,9.81 96.3,28.39 v93.49,31.2 | v104.62,50.62 104.62,57.76 v101.01,61.37 124.54,61.37 v124.64,61.28
BAT_UP
  Top 2.54: 54.55,109.75 55.72,109.75 SV1.19 | SV1.19 SV1.21 SV1.23 SV1.25 SV1.27 | SV1.19 SV1.17 SV1.15 | SV1.15 56.7,114.43 56.78,114.51 56.78,113.93 SV1.15 | SV1.15 SV1.13 SV1.11 SV1.9
  Top 5: FUSE1.1 80.45,21.06 32.52,68.99 32.52,105.04 36.51,109.04 47.98,109.04 48.69,109.75 54.55,109.75
CAPACITOR  (via drill 0.5)
  Top 0.508: v86.08,44.44 88.85,47.2 v88.85,58.25 | v63.26,71.79 63.26,83.84 61.01,86.08 61.01,94.29 SV1.30
  Bottom 0.508: R79.2 95.61,39.95 92.27,39.95 92.19,40.04 88.81,40.04 86.08,42.76 v86.08,44.44 | v88.85,58.25 75.31,71.79 v63.26,71.79
  Bottom 1.27: Q3.G 98.86,41.08 R79.2
GND  (via drill 0.35, 0.5)
  Top 0.3: v148.25,101.2 148.25,92.51 v148.16,92.42 | v99.98,175.29 100.98,176.29 113.1,176.29 v113.9,175.48
  Top 0.305: v83.6,48.18 84.58,49.29 v84.13,51.46 | v71.8,58.46 72.35,57.91 73.04,56.46 72.64,54.95 69.13,54.63 v60.87,60.08 v57.61,64.36 | v66.88,159.41 v69.1,160.56 | v55.09,149.22 54.75,152.57 58.75,157.42 v61.62,158.12 | v99.98,175.29 99.78,175.49 95.1,175.49 87.43,173.64 v85.67,171.87 | v114.84,166.52 v121.27,164.35 131.99,162.32 v134.33,161.88
  Top 0.406: v70.98,82.2 v67.29,81.33 | v149.35,109.34 153.3,109.34 v153.88,108.76
  Top 0.508: C6.2 124.38,68.04 118.97,68.04 117.11,69.91 C4.2 | v124.61,55.15 126.3,55.15 127.88,56.73 Z2.A | IO2.6 v100.94,47.97 | v57.61,64.36 v48.72,77.63 | v151.05,87.42 151.05,90.63 v151.12,90.7 | v153.88,108.76 163.79,108.76 v165.68,106.87 | v149.26,123.69 146.72,123.69 144.13,121.11 v144.13,118.66
  Top 0.61: C48.2 70.71,107.63 69.54,108.8 SV1.20
  Top 0.813: IO2.6 91.75,57.55 IO2.5 91.53,65.04 C3.2 | IO2.6 IO2.3 | IO1.6 109.3,57.18 IO1.5 107.55,64.45 Z1.A 107.43,68.42 106.47,69.38 C2.2 | IO1.6 IO1.3 112.71,67.33 115.28,69.91 C4.2 | IO1.6 104.49,53.78 C1.2 95.69,53.61 IO2.6 | C5.2 119.38,53.78 IO1.6 | C45.2 C46.2 64.75,92.7 64.75,88.68 65.13,88.3 70.01,88.3 70.92,89.22 IC2.1 70.68,90.67 C43.2 C48.2
  Top 1.27: TRIM.1 86.65,19.01 99.76,18.94 C49.-
  Top 5: C49.- 106.36,14.66 112.58,8.44 122.74,8.44 141.79,27.49 141.79,33.84 | C50.- 141.92,51.48 137.96,55.44 137.96,65.27 124.18,79.05 | U$5.3 U$5.4 124.18,79.05 | 124.18,79.05 124.18,89.21 131.45,96.49 131.45,117.12 117.18,131.39 95.71,131.39 93.41,129.09 SV1.4
  Bottom 0.3: AT28BV25628T.21 153.9,108.75 v153.88,108.76 | OR_5.7 148.93,101.88 v148.25,101.2 | v148.16,92.42 149.64,90.94 OR_6.7 | 108.25,166.17 108.7,166.6 109.6,167 113,166.3 114.76,166.61 | 107.4,166.17 COMP_1.2
  Bottom 0.305: COMP_17.2 119.78,48.48 119.56,48.7 118.55,48.7 | 118.55,48.7 115.27,45.42 R78.1 | C35.2 118.11,51.06 117.79,50.73 117.79,49.46 118.55,48.7 | R38.2 141.61,51.37 138.34,54.65 138.01,56.93 140.65,59.24 | 140.65,59.24 141.66,60.13 COMP_19.2 | COMP_18.2 131.25,53.78 129.85,53.78 129.41,54.22 | 129.36,54.64 129.41,55.45 C36.2 | 140.65,59.24 138.85,61.04 C37.2 138.85,62.42 138.85,62.9 139.38,63.43 142.93,63.43 OR_3.7 143.16,66.08 C38.2 | 154.43,58.23 R39.2 | C38.2 150.71,68.26 150.88,68.26 COMP_20.2 152.21,66.93 152.65,66.48 152.83,66.48 155.51,63.81 155.51,60.25 154.75,59.5 R40.2 154.49,58.29 154.43,58.23 | C41.2 153.41,57.21 154.43,58.23 | COMP_21.2 159.07,77.77 158.81,78.03 158.62,78.73 158.62,79.32 C39.2 | C40.2 164.62,90.67 163.84,90.43 163.46,89.34 COMP_22.2 | R45.2 172.18,95.61 R46.2 | C14.2 157.79,137.98 157.79,137.6 158.3,136.71 | 158.3,136.71 COMP_26.2 | 152.33,145.6 151.7,146.36 C15.2 151.91,151.22 152.1,152.72 C9.2 151.85,156.01 150.29,158.13 | 152.33,145.6 COMP_27.2 | R56.2 150.29,158.13 | 150.29,158.13 150.86,158.88 | 150.86,158.88 R55.2 | R57.2 R58.2 v134.33,161.88 | COMP_29.2 131.25,161.22 | 131.25,161.22 129.98,161.85 C17.2 | R59.2 R60.2 v121.27,164.35 119.56,164.9 | C18.2 118.29,165.41 118.55,165.16 119.56,164.9 | 119.56,164.9 COMP_30.2 | 108.25,166.17 107.4,166.17 106.1,166.17 C19.2 | R4.2 R3.2 | C20.2 94.16,164.78 95.43,165.03 95.41,165.17 | 95.41,165.17 COMP_2.2 | R5.2 85.1,169.45 | 85.1,169.45 86.57,167.98 87.47,166.04 87.34,162.99 83.62,161.09 | 85.1,169.45 R6.2 85.16,170.42 v85.67,171.87 | COMP_3.2 83.62,161.09 | 83.62,161.09 82.61,160.71 C21.2 R8.2 72.24,164.08 | R7.2 72.24,164.08
  Bottom 0.305: C22.2 72.96,155.26 74.1,156.11 73.61,156.71 COMP_4.2 72.71,157.67 71.16,157.87 70.72,158.26 v69.1,160.56 68.8,160.98 69.41,161.7 70.2,162.64 72.24,164.08 | R10.2 R9.2 | C23.2 63.3,146.11 63.94,146.87 | 63.94,146.87 COMP_5.2 | R11.2 R12.2 | COMP_6.2 57.41,138.46 57.59,138.36 | 57.59,138.36 56.95,137.47 C24.2 | R14.2 R13.2 | C25.2 51.24,124.52 51.75,125.66 | 51.75,125.66 51.38,125.77 COMP_7.2 | R15.2 R16.2 43.28,119.6 46.77,119.6 49.29,117.55 48.95,113.59 | C26.2 48.83,112.45 48.95,113.59 | COMP_8.2 48.95,113.59 | R17.2 R18.2 | COMP_9.2 48.95,102.42 49.08,101.4 C27.2 | C28.2 51.89,89.17 51.61,90.12 51.33,90.06 51.22,90.04 | 51.52,90.1 51.22,90.04 | 51.22,90.04 COMP_10.2 | R19.2 R20.2 | COMP_11.2 56.62,78.24 57.4,76.99 C29.2 | R23.2 54.62,66.55 | 54.62,66.55 R24.2 55.37,68.32 57.09,70.04 61.48,70.04 62.64,68.88 | COMP_12.2 62.64,68.88 | 62.64,68.88 62.75,68.98 63.59,68.01 C30.2 | R25.2 R26.2 | R27.2 R28.2 76.5,52.91 78.11,56.18 78.19,56.15 | 83.45,53.9 84.67,53.4 85.37,52.56 | 85.37,52.56 C32.2 | COMP_15.2 94.41,49.99 | 94.41,49.99 95.5,49.76 C33.2 | 149.75,75.36 149.71,75.27 C38.2 | v100.94,47.97 104.96,47.55 106.79,48.67 107.42,48.69 | 107.42,48.69 COMP_16.2 | 107.42,48.69 107.44,49.82 107.37,50.88 107.39,52.12 107.51,52.8 109.21,52.82 C34.2 | 94.41,49.99 93.26,50.23 92.06,49.02 92.06,46.71 R30.2 R29.2 86.84,43.81 86.84,44.75 83.6,47.99 v83.6,48.18 | v84.13,51.46 85.37,52.56 | 83.45,53.9 82.49,54.34 79.61,55.31 78.19,56.15 | 78.19,56.15 C31.2 74,59.4 73.06,60.08 COMP_13.2 v71.8,58.46 | COMP_14.2 83.45,53.9 | C7.2 v60.87,60.08 | v57.61,64.36 56.15,64.84 54.62,66.55 | COMP_24.2 168.18,109.89 | 168.18,109.89 166.92,109.74 C12.2
  Bottom 0.305: 168.18,109.89 168.82,104.67 171.46,104.98 172.42,105.94 R48.2 R47.2 | 51.75,125.66 55.29,124.45 SV1.7 | 57.59,138.36 58.21,139.53 | 58.21,139.53 57.95,139.77 57.95,142.27 55.61,144.56 R12.2 | 58.21,139.53 60.26,142.85 63.5,143.37 65.25,145.22 | 65.25,145.22 65.25,145.75 63.94,146.87 | 65.25,145.22 69.22,147.59 OR_1.7 | C8.2 v66.88,159.41 | 95.41,165.17 100.05,166.02 100.05,171.45 R4.2 | R12.2 v55.09,149.22 | v99.98,175.29 100.05,174.46 R4.2 | v113.9,175.48 113.39,175.48 112.41,174.51 R2.2 | 114.76,166.61 v114.84,166.52 | 131.25,161.22 132.8,160.56 v134.33,161.88 | v134.33,161.88 C16.2 141.15,155.76 142.03,155.13 142.04,155.12 COMP_28.2 143.47,156.67 144.96,159.08 146.26,160.38 149.05,160.24 150.86,158.88 | R53.2 R54.2 C14.2 | C14.2 154.97,142.55 | 154.97,142.55 152.33,145.6 | OR_4.7 150.33,143.67 154.97,142.55 | 158.3,136.71 159,135.34 161.32,133.89 R52.2 C13.2 | COMP_25.2 163.38,125.45 | !OE.1 144.87,111.63 !WE.1 !CE.1
  Bottom 0.406: R2.2 R1.2 | R41.2 R42.2 | OR_6.7 149.68,91.5 C10.2 | 62.75,68.98 63.86,69.98 64.83,70.13 67.08,69.73 67.41,69.4 OR_2.7 | 55.71,79.61 58.29,80.89 60.3,79.99 62.75,77.87 C44.2 65.83,79.85 v67.29,81.33 | IC1.11 71.28,81.97 v70.98,82.2 | v144.13,118.66 144.13,119.09 144.85,119.81 145.47,119.81 149.41,115.87 149.41,109.4 v149.35,109.34
  Bottom 0.508: R35.2 R36.2 128.67,45.3 124.61,49.37 v124.61,55.15 124.61,56.03 123.93,56.71 | R38.2 R37.2 | 123.93,56.71 120.77,56.71 118.11,54.05 C35.2 C34.2 | 123.93,56.71 C36.2 | 138.85,62.42 134.37,62.42 129.49,57.54 C36.2 129.49,55.53 129.41,55.45 129.41,54.22 | R44.2 R43.2 | C39.2 167.24,80.85 R44.2 | R49.2 R50.2 168.75,120.3 165.89,120.3 165.08,121.12 163.38,125.45 163.1,126.39 C13.2 | R52.2 164.65,133.28 167.82,132.26 171.38,133.79 171.76,136.2 R51.2 | C38.2 149.42,74.53 | 149.42,74.53 149.75,75.36 C11.2 151.67,81.16 153.1,82.6 153.1,87 152.58,87.52 151.15,87.52 v151.05,87.42 | R42.2 159.93,70.31 153.88,72.74 154.54,73.44 | 149.42,74.53 153.88,72.74 154.54,73.44 | 158.62,78.73 157.52,76.57 154.54,73.44 | C12.2 v165.68,106.87 C42.2 165.88,101.53 165.79,100.89 | R46.2 169.97,93.93 168.42,93.93 163.91,96.02 | 165.79,100.89 165.48,98.84 164.12,96.38 163.91,96.02 | 165.79,100.89 COMP_23.2 | 163.91,96.02 161.89,92.39 161.61,90.31 161.85,89.84 162.14,89.76 163.46,89.34 162.89,87.72 R44.2 | C44.2 C47.2 | R79.1 C33.2 | v100.94,47.97 R79.1 | R79.1 102.37,43.46 R32.2 | SOLENOID.2 103.07,38.16 R31.2 | C7.2 61.59,57.5 R25.2 | R22.2 55.04,80.26 55.71,79.61 56.09,79.25 56.62,78.24 | 51.52,90.1 51.33,91.37 46.22,92.35 R20.2 | 48.5,99.95 C27.2 | 48.95,102.42 48.96,103.88 47.03,104.39 | 47.03,104.39 45.95,104.68 45.82,103.62 43.69,104.19 42.07,105.8 R18.2 | R21.2 v48.72,77.63 R22.2 | R22.2 50.18,82.75 50.18,86.54 51.39,87.75 C28.2 | C26.2 47.03,104.39 | R14.2 SV1.1 55.45,135.35 C24.2 | C8.2 62.49,158.87 v61.62,158.12 R9.2 | v151.12,90.7 149.65,90.7 OR_6.7 | C51.2 v149.26,123.69 | v144.13,118.66 144.87,117.92 !OE.1
  Bottom 0.508: C52.1 78.4,11.03 TRIM.1 | R2.2 113.22,173.41 115.19,171.44 115.19,166.87 v114.84,166.52
  Bottom 0.61: R81.2 101.15,41.46 101.28,41.59 R32.2 R31.2 | R78.1 115.27,43.22 R34.2 R33.2 | SV1.7 54.36,120.94 54.21,101.69 51.48,96.68 51.23,96.43 44.97,96.43 | R20.2 43.74,95.19 44.97,96.43 | 44.97,96.43 48.5,99.95
  Bottom 2: SV1.7 SV1.5 SV1.3 SV1.1
  Bottom 2.54: SOLENOID.2 106.23,15.93 C49.- | SV1.7 SV1.8 | SV1.8 SV1.6 SV1.4 SV1.2 | SV1.8 SV1.10 SV1.12 SV1.14 SV1.16 SV1.18 SV1.20
  pour Bottom (isolate 1.016): 9.96,152.7 arc49 9.74,62.78 arc110 16.2,61.62 16.62,62.03 arc-45 19.44,63.2 26.13,63.2 arc-45 28.96,62.03 61.96,29 arc-45 63.13,26.17 63.13,19.49 arc-45 61.95,16.66 61.54,16.24 arc110 62.7,9.78 arc49 152.3,9.78 arc110 153.46,16.24 153.04,16.66 arc-45 151.87,19.49 151.87,26.17 arc-45 153.04,29 186.04,62.03 arc-45 188.87,63.2 195.55,63.2 arc-45 198.38,62.03 198.79,61.62 arc110 205.26,62.78 arc49 205.04,152.7 arc110 198.58,153.84 196.41,151.67 arc-45 193.58,150.5 191.16,150.5 arc-45 188.33,151.67 151.03,188.93 arc-85 150.77,194.31 157.23,202.12 arc102 157.08,202.88 arc2 154.45,204.2 arc76 153.84,204.07 132.12,177.8 82.88,177.8 61.15,204.07 arc76 60.55,204.2 arc2 57.92,202.88 arc102 57.77,202.12 64.23,194.31 arc-85 63.97,188.93 26.67,151.67 arc-45 23.84,150.5 21.42,150.5 arc-45 18.59,151.67 16.42,153.84 arc110
  pour Top (isolate 0.813): 9.96,152.7 arc49 9.74,62.78 arc110 16.2,61.62 16.62,62.03 arc-45 19.44,63.2 26.13,63.2 arc-45 28.96,62.03 61.96,29 arc-45 63.13,26.17 63.13,19.49 arc-45 61.95,16.66 61.54,16.24 arc110 62.7,9.78 arc49 152.3,9.78 arc110 153.46,16.24 153.04,16.66 arc-45 151.87,19.49 151.87,26.17 arc-45 153.04,29 186.04,62.03 arc-45 188.87,63.2 195.55,63.2 arc-45 198.38,62.03 198.79,61.62 arc110 205.26,62.78 arc49 205.04,152.7 arc110 198.58,153.84 196.41,151.67 arc-45 193.58,150.5 191.16,150.5 arc-45 188.33,151.67 151.03,188.93 arc-85 150.77,194.31 157.23,202.12 arc102 157.08,202.88 arc2 154.45,204.2 arc76 153.84,204.07 132.12,177.8 82.88,177.8 61.15,204.07 arc76 60.55,204.2 arc2 57.92,202.88 arc102 57.77,202.12 64.23,194.31 arc-85 63.97,188.93 26.67,151.67 arc-45 23.84,150.5 21.42,150.5 arc-45 18.59,151.67 16.42,153.84 arc110
INT
  Bottom 0.406: Q1.3 66.67,94.53 R77.2 | OR_6.6 143.95,89.44 139.64,93.75 136.6,93.75 120.09,77.23 120.09,73.11
  Bottom 0.508: Q1.3 64.32,95.77 66.64,98.09 68.85,98.09 95.59,71.35 118.33,71.35 120.09,73.11
INT_3V
  Bottom 0.406: SV1.32 62.37,93.53 Q1.2 63.47,92.43 R73.2
IO0  (via drill 0.35)
  Top 0.406: v78.31,74.36 78.34,74.33 v81.64,74.33 | v151.76,101.24 149.46,98.93 149.46,88.18 v135.06,73.78
  Bottom 0.305: AT28BV25628T.18 155.55,103.8 152.99,101.24
  Bottom 0.406: v151.76,101.24 152.99,101.24 153.66,100.57 155.47,100.57 OR_5.9 | IC1.20 70.71,74.36 v78.31,74.36 | v81.64,74.33 82,74.33 92.31,64.03 125.3,64.03 v135.06,73.78 136.33,75.05 136.33,85.97 137.99,87.63 IO_0.TP
IO0,1
  Bottom 0.508: OR_6.10 157.66,88.17 158.42,88.92 158.42,100.74 157.28,101.88 OR_5.8
IO0,1,2,3
  Bottom 0.508: OR_6.8 154.24,90.71 151.73,88.2 150.72,88.2 150.69,88.17 OR_6.5
IO0_3V
  Bottom 0.406: IC1.1 61.7,83.37 SV1.40
IO1  (via drill 0.35)
  Top 0.305: 152.58,102.13 152.92,102.13 v153.01,102.23
  Top 0.406: v81.64,75.24 78.34,75.24 v78.31,75.27 | v153.67,99.58 153.87,99.78 153.87,101.73 153.47,102.13 152.58,102.13 151.62,102.13 148.9,99.41 148.9,88.9 v134.42,74.42
  Bottom 0.305: v153.01,102.23 155,104.21 AT28BV25628T.19
  Bottom 0.406: v153.67,99.58 153.91,99.34 OR_5.10 | IC1.18 71.64,75.27 v78.31,75.27 | v81.64,75.24 82.38,75.24 92.69,64.94 124.93,64.94 v134.42,74.42 135.59,75.6 135.59,86.6 136.89,87.9 136.89,89.32 IO_1.TP
IO1_3V
  Bottom 0.406: IC1.3 62.25,84.66 57.88,84.66 56.7,83.48 SV1.39
IO2  (via drill 0.35)
  Top 0.406: v81.64,76.15 78.34,76.15 v78.31,76.17 | v147.18,94.25 147.42,94.01 147.42,88.71 v133.77,75.07
  Bottom 0.305: AT28BV25628T.20 154.45,104.99 152.04,102.58 148.31,102.58 145.37,99.63 145.37,96.06 v147.18,94.25
  Bottom 0.406: v147.18,94.25 149.88,94.25 OR_5.1 | IC1.17 71.65,76.17 v78.31,76.17 | v81.64,76.15 82.76,76.15 93.06,65.84 124.55,65.84 v133.77,75.07 134.83,76.12 134.83,87.85 IO_2.TP
IO2,3  (via drill 0.5)
  Top 0.508: v157.28,89.46 154.75,91.99 154.75,94.85 v153.49,96.11
  Bottom 0.508: OR_6.9 157.25,89.44 v157.28,89.46 | v153.49,96.11 152.8,96.8 OR_5.3
IO2_3V
  Bottom 0.406: IC1.4 61.91,85.91 SV1.38
IO3  (via drill 0.35)
  Top 0.406: v78.31,77.08 78.34,77.06 v81.64,77.06 | v147.03,95.52 146.44,94.93 146.44,93.71 146.86,93.29 146.86,89.43 v133.13,75.71
  Bottom 0.305: AT28BV25628T.22 153.35,104.53 151.85,103.04 147.85,103.04 144.85,100.04 144.85,94.79 146.45,93.19 150.69,93.19 151.2,93.7 151.2,95.34 151,95.54 149.91,95.54 OR_5.2
  Bottom 0.406: v147.03,95.52 149.88,95.52 OR_5.2 | IC1.16 71.66,77.08 v78.31,77.08 | v81.64,77.06 83.13,77.06 93.44,66.75 124.18,66.75 v133.13,75.71 133.93,76.51 133.93,85.22 IO_3.TP
IO3_3V
  Bottom 0.406: IC1.5 61.61,87.13 56.99,87.13 56.7,86.84 SV1.37
IO4  (via drill 0.35)
  Top 0.305: v146.12,92.33 146.26,92.33 146.3,92.36
  Top 0.406: v81.64,77.97 78.34,77.97 v78.31,77.99 | v147.04,98.14 147.04,97.5 145.88,96.34 145.88,93.41 146.3,93 146.3,92.36 146.3,90.16 v132.49,76.35
  Bottom 0.305: v146.12,92.33 144.4,94.06 144.4,100.23 147.66,103.49 151.12,103.49 152.8,105.17 AT28BV25628T.23
  Bottom 0.406: v147.04,98.14 149.83,98.14 OR_5.4 | IO_4.TP 131.17,84.68 133.12,82.73 133.12,76.98 v132.49,76.35 123.8,67.66 93.82,67.66 83.51,77.97 v81.64,77.97 | IC1.15 71.67,77.99 v78.31,77.99
IO4,5  (via drill 0.5)
  Top 0.508: v151.93,99.63 151.93,86.5 v151.48,86.05
  Bottom 0.508: OR_5.6 150.94,100.61 v151.93,99.63 | v151.48,86.05 152.23,85.29 152.23,83.67 151.65,83.09 OR_6.1
IO4,5,6,7
  Bottom 0.508: OR_6.3 OR_6.4
IO4_3V
  Bottom 0.406: IC1.6 61.21,88.45 SV1.36
IO5  (via drill 0.35)
  Top 0.305: v145.19,91.57 145.05,91.57 145.01,91.61
  Top 0.406: v81.64,78.88 78.34,78.88 v78.31,78.9 | v146.05,99.35 146.05,97.94 145.01,96.9 145.01,91.61 145.01,90.16 v131.84,76.99
  Bottom 0.305: v145.19,91.57 143.94,92.82 143.94,100.42 147.47,103.95 150.93,103.95 152.25,105.27 AT28BV25628T.24
  Bottom 0.406: v146.05,99.35 OR_5.5 | IC1.14 71.68,78.9 v78.31,78.9 | v81.64,78.88 83.89,78.88 94.19,68.57 123.42,68.57 v131.84,76.99 132.27,77.42 132.27,79.81 IO_5.TP
IO5_3V
  Bottom 0.406: IC1.7 60.89,89.69 57.73,89.69 56.7,88.66 SV1.35
IO6  (via drill 0.35)
  Top 0.406: v81.64,79.79 78.34,79.79 v78.31,79.81 | v157.38,96.85 154.59,99.64 154.59,102.09 153.72,102.96 148.63,102.96 143.85,98.19 v143.85,90.9 143.85,90.28 v131.2,77.64
  Bottom 0.305: AT28BV25628T.25 151.7,105.37 150.74,104.41 147.28,104.41 143.41,100.54 143.41,91.33 v143.85,90.9
  Bottom 0.406: v78.31,79.81 74.61,79.81 74.36,79.56 71.94,79.56 IC1.13 | v157.38,96.85 157.33,96.8 OR_5.12 | v81.64,79.79 84.26,79.79 94.57,69.48 123.05,69.48 v131.2,77.64 131.5,77.93 131.5,78.74 130.78,79.46 129.09,79.46 IO_6.TP
IO6,7  (via drill 0.5)
  Top 0.508: v151.17,84.49 151.37,84.49 152.63,85.75 152.63,96.96 153.38,97.7 v153.38,98.35
  Bottom 0.508: OR_5.11 153.66,98.07 v153.38,98.35 | v151.17,84.49 149.78,84.49 OR_6.2
IO6_3V
  Bottom 0.406: IC1.8 60.51,90.99 SV1.34
IO7  (via drill 0.35)
  Top 0.406: v78.31,80.72 78.34,80.69 v81.64,80.69 | v157.56,95.54 158.31,96.3 158.31,97.58 155.4,100.49 155.4,102.27 154.02,103.66 148.27,103.66 v142.25,97.64 142.25,89.97 v130.56,78.28
  Bottom 0.305: v142.25,97.64 142.25,100.03 147.09,104.86 150.19,104.86 151.15,105.83 AT28BV25628T.26
  Bottom 0.406: v78.31,80.72 74.73,80.72 74.13,80.12 72.3,80.12 IC1.12 | v157.56,95.54 157.54,95.53 OR_5.13 | v81.64,80.69 84.64,80.69 94.95,70.39 122.67,70.39 v130.56,78.28 126.91,78.28 IO_7.TP
IO7_3V
  Bottom 0.406: IC1.9 60.19,92.23 57.94,92.23 SV1.33
KICK  (via drill 0.35)
  Top 0.813: v109.6,37.88 105.95,37.88 104.87,36.8 104.87,31.81 96.34,23.27 86.01,23.27 72.14,37.14 70.89,37.14 37.79,70.25 37.79,92.76 38.55,93.52 v46.58,93.52
  Bottom 0.813: R78.2 112.58,44.61 Q2.G 112.52,40.13 110.88,40.13 109.6,38.85 v109.6,37.88 | v46.58,93.52 SV1.31
L1  (via drill 0.5)
  Top 0.305: v65.66,156.11 68.34,155.87 70.64,155.39 76.26,157.6 92.4,163.41 v109.26,165.98
  Bottom 0.305: OR_1.1 66.49,156.86 v65.66,156.11 | v109.26,165.98 COMP_1.4
L2  (via drill 0.5)
  Top 0.305: v76.61,154.52 68.53,152.07 67.45,152.36 v66.6,155
  Bottom 0.305: COMP_2.4 96.48,163.27 v76.61,154.52 | v66.6,155 OR_1.2
L3  (via drill 0.5)
  Top 0.305: v68.14,153.25 v85.16,159.43
  Bottom 0.305: OR_1.4 v68.14,153.25 | v85.16,159.43 COMP_3.4
L4
  Bottom 0.305: OR_1.5 71.17,154.1 72.55,152.68 73.29,152.59 75.49,154.34 COMP_4.4
L5
  Bottom 0.305: COMP_5.4 65.46,147.76 OR_1.9
L6  (via drill 0.5)
  Top 0.305: v59.25,139.24 61.68,145.33 v64.6,148.74
  Bottom 0.305: COMP_6.4 v59.25,139.24 | v64.6,148.74 OR_1.10
L7  (via drill 0.5)
  Top 0.305: v53.09,127.03 54.69,132.76 55.42,133.42 56.09,133.64 56.83,133.71 57.43,133.75 57.92,134 58.25,135.13 60.72,139.69 62.24,144.78 65.64,148.04 66,150.57 v65.51,152.66
  Bottom 0.305: COMP_7.4 v53.09,127.03 | v65.51,152.66 OR_1.12
L8  (via drill 0.5)
  Top 0.305: v51.31,114.05 55.02,131.23 55.45,132.52 56.42,133.07 57.65,133.07 58.69,133.75 59,134.98 arc45 59.02,135.01 59.02,135.14 61.38,139.4 62.87,144.43 65.84,146.97 66.51,148.46 66.59,150.87 66.56,153.19 v65.51,154.12
  Bottom 0.305: COMP_8.4 v51.31,114.05 | v65.51,154.12 OR_1.13
L9  (via drill 0.5)
  Top 0.305: v63.97,60.16 59.62,65.02 58.44,67.19 57.32,73.02 55.55,76.79 53.03,81.95 51.11,95.97 v51.24,103.4
  Bottom 0.305: OR_2.1 v63.97,60.16 | v51.24,103.4 COMP_9.4
L10  (via drill 0.5)
  Top 0.305: v64.72,61.26 62.66,67.25 54.5,81.33 v53.42,91.54
  Bottom 0.305: OR_2.2 v64.72,61.26 | v53.42,91.54 COMP_10.4
L11  (via drill 0.5)
  Top 0.305: v66.1,63.1 60.05,76.51 v58.72,79.45
  Bottom 0.305: OR_2.4 v66.1,63.1 | v58.72,79.45 58.01,79.76 COMP_11.4
L12
  Bottom 0.305: OR_2.5 66.56,64.79 67.24,64.86 69.41,66.99 69.47,68.38 67.44,70.38 63.97,70.74 COMP_12.4
L13
  Bottom 0.305: OR_2.9 COMP_13.4
L14
  Bottom 0.305: OR_2.10 70,61.84 69.15,62.69 69.15,63.6 70.88,65.32 72.38,65.32 82.45,55.24 COMP_14.4
L15
  Bottom 0.305: OR_2.12 67.38,60.9 67.54,62.14 68.27,63.79 70.46,65.94 72.52,65.93 COMP_15.4
L16
  Bottom 0.305: OR_2.13 66.68,59.78 66.79,62.06 67.6,63.87 70.01,66.31 70.62,66.57 72.93,66.51 94.54,52.84 100.75,51.14 102.9,48.93 104.83,48.48 105.93,48.83 106.8,49.56 COMP_16.4
L17  (via drill 0.35 pad 0.6, 0.5)
  Top 0.508: v148.37,56.41 149.57,55.21 149.57,49.81 v145.57,45.81 | v131.17,39.67 131.17,40.71 123.31,48.57 v122.99,48.57
  Bottom 0.305: COMP_17.4 119.34,49.33 122.23,49.33 v122.99,48.57
  Bottom 0.508: OR_3.1 148.06,56.72 v148.37,56.41 | v145.57,45.81 139.43,39.67 v131.17,39.67
L18  (via drill 0.35, 0.35 pad 0.6)
  Top 0.508: v149.71,58.42 151.06,57.07 151.06,48.19 v145.95,43.08 | v132.99,38.33 132.99,42.73 129.47,46.25 129.47,52.65 132.1,55.28 v134.22,55.28
  Bottom 0.305: COMP_18.4 131.38,54.29 v134.22,55.28
  Bottom 0.508: OR_3.2 148.17,58.79 148.37,58.99 149.14,58.99 v149.71,58.42 | v145.95,43.08 141.2,38.33 v132.99,38.33
L19
  Bottom 0.305: COMP_19.4 143.36,60.71 144.08,60 144.87,60 OR_3.4
L20
  Bottom 0.305: COMP_20.4 149.18,68.89 147.38,68.89 144.46,65.97 144.46,64.32 145.6,63.18 145.6,62.52 OR_3.5
L21  (via drill 0.5)
  Top 0.305: v149.2,67.53 v152.99,76.8
  Bottom 0.305: v149.2,67.53 148.28,66.3 OR_3.9 | v152.99,76.8 COMP_21.4
L22  (via drill 0.5)
  Top 0.305: v150.16,66.59 151.62,69.56 155.05,78.4 161.15,89.18 v161.15,89.26
  Bottom 0.305: OR_3.10 v150.16,66.59 | COMP_22.4 162.17,89.07 v161.15,89.26
L23  (via drill 0.5)
  Top 0.305: v151.66,64.89 151.36,67.63 152.22,69.34 155.83,78.13 156.75,80.21 162.22,88.81 163.63,97.64 v163.63,100.38
  Bottom 0.305: OR_3.12 v151.66,64.89 | v163.63,100.38 COMP_23.4
L24  (via drill 0.5)
  Top 0.305: v167.18,107.7 162.99,89.03 158.27,81.16 152.94,69.04 152.21,68.3 152.21,66.55 154.8,65.09 153.16,63.45 v152.64,63.45
  Bottom 0.305: OR_3.13 v152.64,63.45 | v167.18,107.7 COMP_24.4
L25  (via drill 0.5)
  Top 0.305: v148.71,154.07 149.72,152.9 152.6,146.74 161.89,127.51 v162.97,123.64
  Bottom 0.305: OR_4.1 v148.71,154.07 | v162.97,123.64 COMP_25.4
L26  (via drill 0.5)
  Top 0.305: v156.77,135.08 v148.72,152.65
  Bottom 0.305: COMP_26.4 v156.77,135.08 | v148.72,152.65 OR_4.2
L27
  Bottom 0.305: OR_4.4 149.15,148.45 148.97,146.8 150.47,144.48 151.31,144.12 COMP_27.4
L28  (via drill 0.5)
  Top 0.305: v146.18,149.25 v141,153.11
  Bottom 0.305: OR_4.5 v146.18,149.25 | v141,153.11 141.67,153.77 COMP_28.4
L29
  Bottom 0.305: OR_4.9 131.46,158.33 COMP_29.4
L30  (via drill 0.5)
  Top 0.305: v143.23,149.45 v121.06,162.83
  Bottom 0.305: OR_4.10 143.96,150.5 v143.23,149.45 | v121.06,162.83 COMP_30.4
N$1
  Bottom 0.406: TCRT_1.K 109.17,175.44 R1.1
N$2
  Bottom 0.406: COMP_1.3 108.02,169.21 TCRT_1.E 108.77,172.65 109.53,173.41 R2.1
  Bottom 0.508: TCRT_1.E 112.79,169.96 1.TP
N$3
  Bottom 0.305: TCRT_2.K R3.1
N$4